# Altium project Receiver.PrjPcb (part 1 of 3)
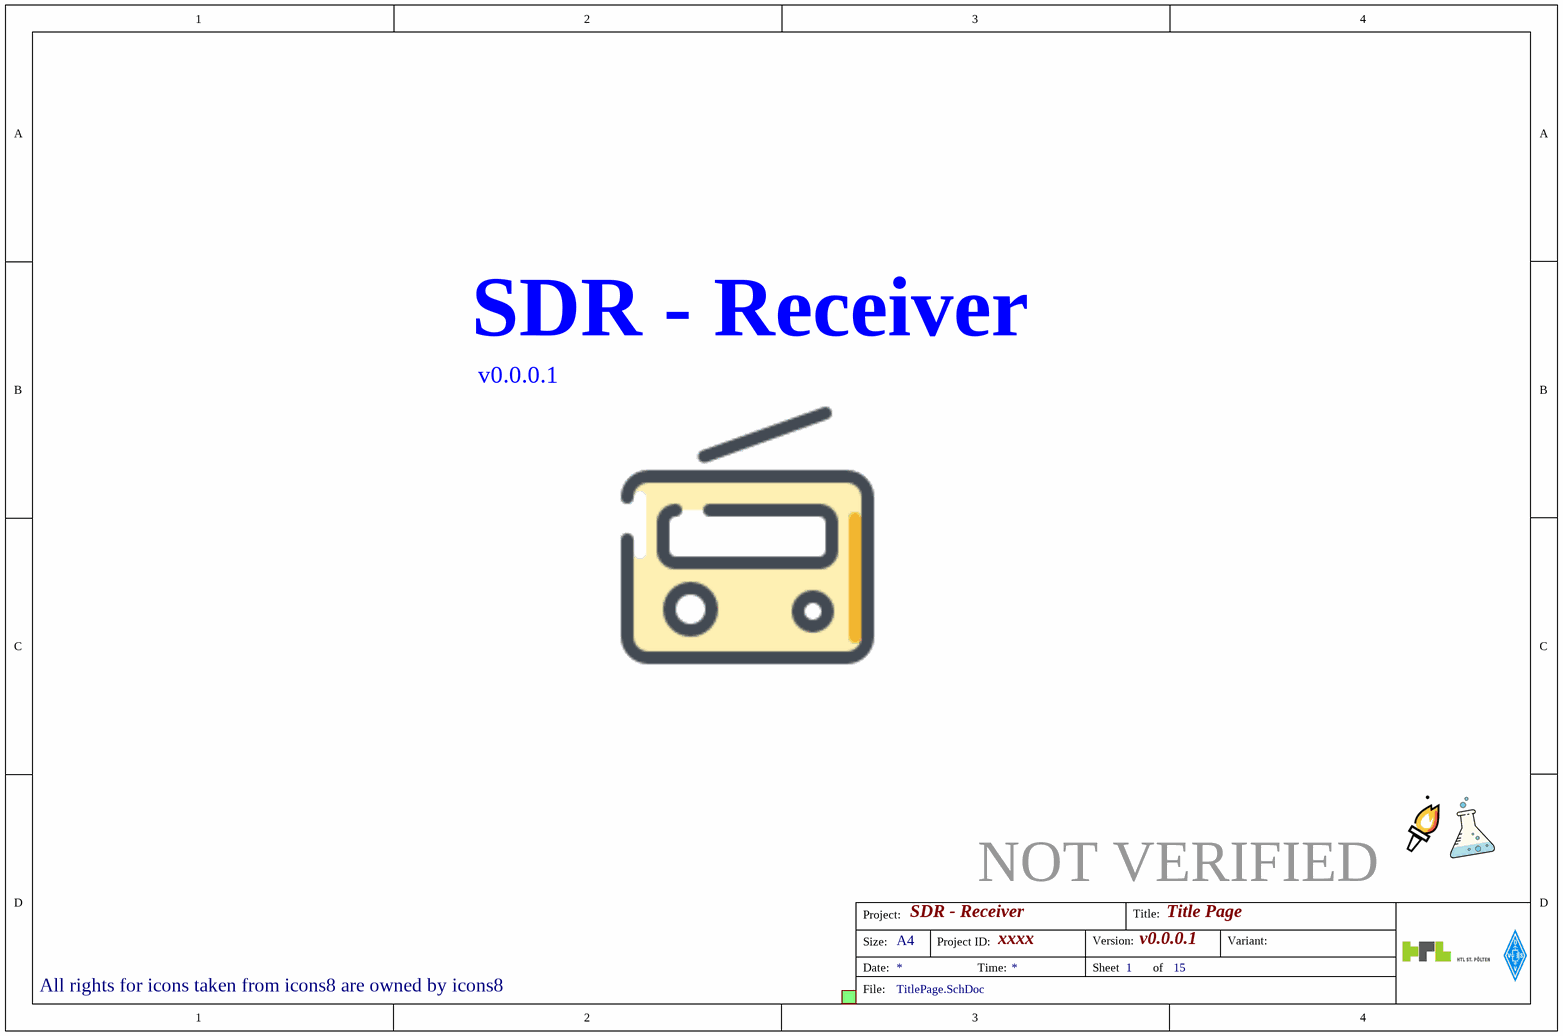
[diagram p0: TitlePage.SchDoc]
Prometheus_Project_ID: xxxx; Prometheus_Release: NOT VERIFIED; Prometheus_Title: SDR - Receiver; Prometheus_Version: v0.0.0.1
15 sheets, 596 parts. Net scope: flat (ports and power ports of the same name join across sheets).
Board file: Receiver.pcbdoc
Sheets:
  TitlePage.SchDoc
    Overview = Overview.SchDoc
      PicoZed = PicoZed.SchDoc
      Power Supply = PowerSupply.SchDoc
      USB & Ethernet = USB_Ethernet.SchDoc
      SD Card = SD_Card.SchDoc
      UART & JTAG = UART_JTAG.SchDoc
      HF Front End = HF_FrontEndOverview.SchDoc
        Low Pass Filter = LowPassFilter.SchDoc
        Programmable Gain Amplifier = ProgrammableGainAmplifier.SchDoc
          ASTG1 = GainBlock.SchDoc
          ASTG2 = GainBlock.SchDoc
          ASTG3 = GainBlock.SchDoc
          Programmable Attenuator = ProgrammableAttenuator.SchDoc
        ADC = ADC.SchDoc
        Clock Generator = ClockGenerator.SchDoc
      Temperature Sensor = TemperatureSensor.SchDoc

## Sheet TitlePage.SchDoc: Title Page
size A4; DrawnBy: Patrik Staudenmayer; DocumentNumber: 1; SheetNumber: 1; SheetTotal: 15

### Sub-sheets
Overview = Overview.SchDoc: no entries

### Notes on the sheet
- SDR - Receiver
- All rights for icons taken from icons8 are owned by icons8 <https://icons8.com>
- Project:
- Title:
- Size:
- Date:
- A4
- Project ID:
- Time:
- Sheet
- Version:
- of
- Variant:
- File:

## Sheet Overview.SchDoc: Overview
size A4; DrawnBy: Patrik Staudenmayer; Organization: Altium Limited; Address1: L3, 12a Rodborough Rd; Address2: Frenchs Forest; Address3: NSW; Address4: Australia 2086; DocumentNumber: 2; SheetNumber: 2; SheetTotal: 15
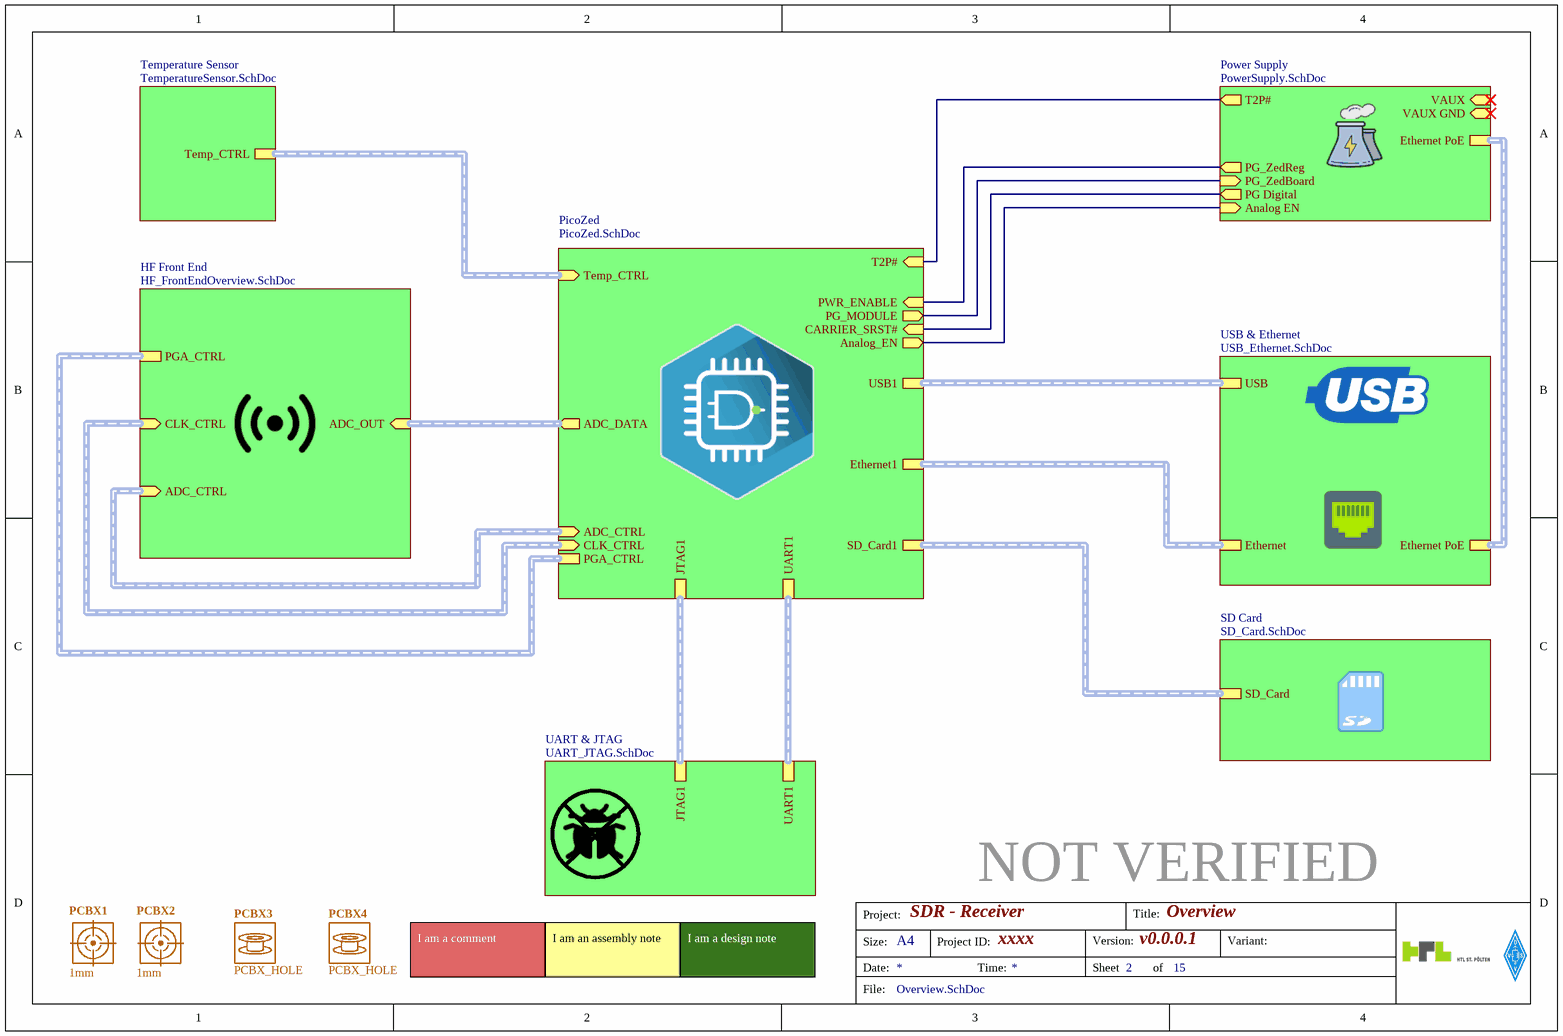
[diagram p1: Overview.SchDoc]

### Parts
PCBX1  1mm  [FIDUCIAL_SINGLESIDE_1mm]  (no BOM)
PCBX2  1mm  [FIDUCIAL_SINGLESIDE_1mm]  (no BOM)
PCBX3  PCBX_HOLE  [TP_FANGFLOCH]  (no BOM)
PCBX4  PCBX_HOLE  [TP_LANGLOCH]  (no BOM)

### Sub-sheets
HF Front End = HF_FrontEndOverview.SchDoc: CLK_CTRL (in, harness CLK_CTRL), ADC_CTRL (in, harness ADC_CTRL), ADC_OUT (in, harness ADC_OUT), PGA_CTRL (harness PGA_CTRL)
PicoZed = PicoZed.SchDoc: USB1 (harness USB), SD_Card1 (harness SD), Ethernet1 (harness Ethernet), JTAG1 (harness JTAG), UART1 (harness UART), PWR_ENABLE (in), PG_MODULE (out), CARRIER_SRST# (in), Analog_EN (out), T2P# (in), ADC_DATA (out, harness ADC_OUT), CLK_CTRL (in, harness CLK_CTRL), ADC_CTRL (in, harness ADC_CTRL), PGA_CTRL, Temp_CTRL (in, harness Temp_CTRL)
Power Supply = PowerSupply.SchDoc: VAUX GND (in), VAUX (in), Ethernet PoE (harness Ethernet PoE), PG Digital (out), PG_ZedBoard (in), PG_ZedReg (out), Analog EN (in), T2P# (out)
SD Card = SD_Card.SchDoc: SD_Card (harness SD)
Temperature Sensor = TemperatureSensor.SchDoc: Temp_CTRL (harness Temp_CTRL)
UART & JTAG = UART_JTAG.SchDoc: JTAG1 (harness JTAG), UART1 (harness UART)
USB & Ethernet = USB_Ethernet.SchDoc: Ethernet PoE (harness Ethernet PoE), Ethernet (harness Ethernet), USB (harness USB)

### Nets
(unnamed): sheet PicoZed/PWR_ENABLE, sheet Power Supply/PG_ZedReg
(unnamed): sheet PicoZed/PG_MODULE, sheet Power Supply/PG_ZedBoard
(unnamed): sheet PicoZed/CARRIER_SRST#, sheet Power Supply/PG Digital
(unnamed): sheet PicoZed/Analog_EN, sheet Power Supply/Analog EN
(unnamed): sheet PicoZed/T2P#, sheet Power Supply/T2P#

### Buses and harness runs
harness sheet HF Front End/ADC_CTRL = sheet PicoZed/ADC_CTRL
harness sheet HF Front End/ADC_OUT = sheet PicoZed/ADC_DATA
harness sheet HF Front End/CLK_CTRL = sheet PicoZed/CLK_CTRL
harness sheet HF Front End/PGA_CTRL = sheet PicoZed/PGA_CTRL
harness sheet PicoZed/Ethernet1 = sheet USB & Ethernet/Ethernet
harness sheet PicoZed/JTAG1 = sheet UART & JTAG/JTAG1
harness sheet PicoZed/SD_Card1 = sheet SD Card/SD_Card
harness sheet PicoZed/Temp_CTRL = sheet Temperature Sensor/Temp_CTRL
harness sheet PicoZed/UART1 = sheet UART & JTAG/UART1
harness sheet PicoZed/USB1 = sheet USB & Ethernet/USB
harness sheet Power Supply/Ethernet PoE = sheet USB & Ethernet/Ethernet PoE

### Notes on the sheet
- I am a comment
- I am an assembly note
- I am a design note
- Project:
- Title:
- Size:
- Date:
- A4
- Project ID:
- Time:
- Sheet
- Version:
- of
- Variant:
- File:

### Library data of the parts
PCBX1 PCBX2 = PCBX_FIDUCIAL: fiducial mark; Prometheus_ID: *; Prometheus_ManPartNo: 1mm; Prometheus_Manufacturer: *; Prometheus_Comment: 1mm; Prometheus_CurrentFootprint: FIDUCIAL_SINGLESIDE_1mm
PCBX3 PCBX4 = PCBX_HOLE: generic PCB hole; Prometheus_ID: *; Prometheus_ManPartNo: PCBX_HOLE; Prometheus_Manufacturer: *; Prometheus_Comment: PCBX_HOLE
  PCBX3: Prometheus_CurrentFootprint: TP_FANGFLOCH
  PCBX4: Prometheus_CurrentFootprint: TP_LANGLOCH

## Sheet PicoZed.SchDoc: Pico Zed
size A2; DrawnBy: Patrik Staudenmayer; Organization: Altium Limited; Address1: L3, 12a Rodborough Rd; Address2: Frenchs Forest; Address3: NSW; Address4: Australia 2086; DocumentNumber: 3; SheetNumber: 3; SheetTotal: 15
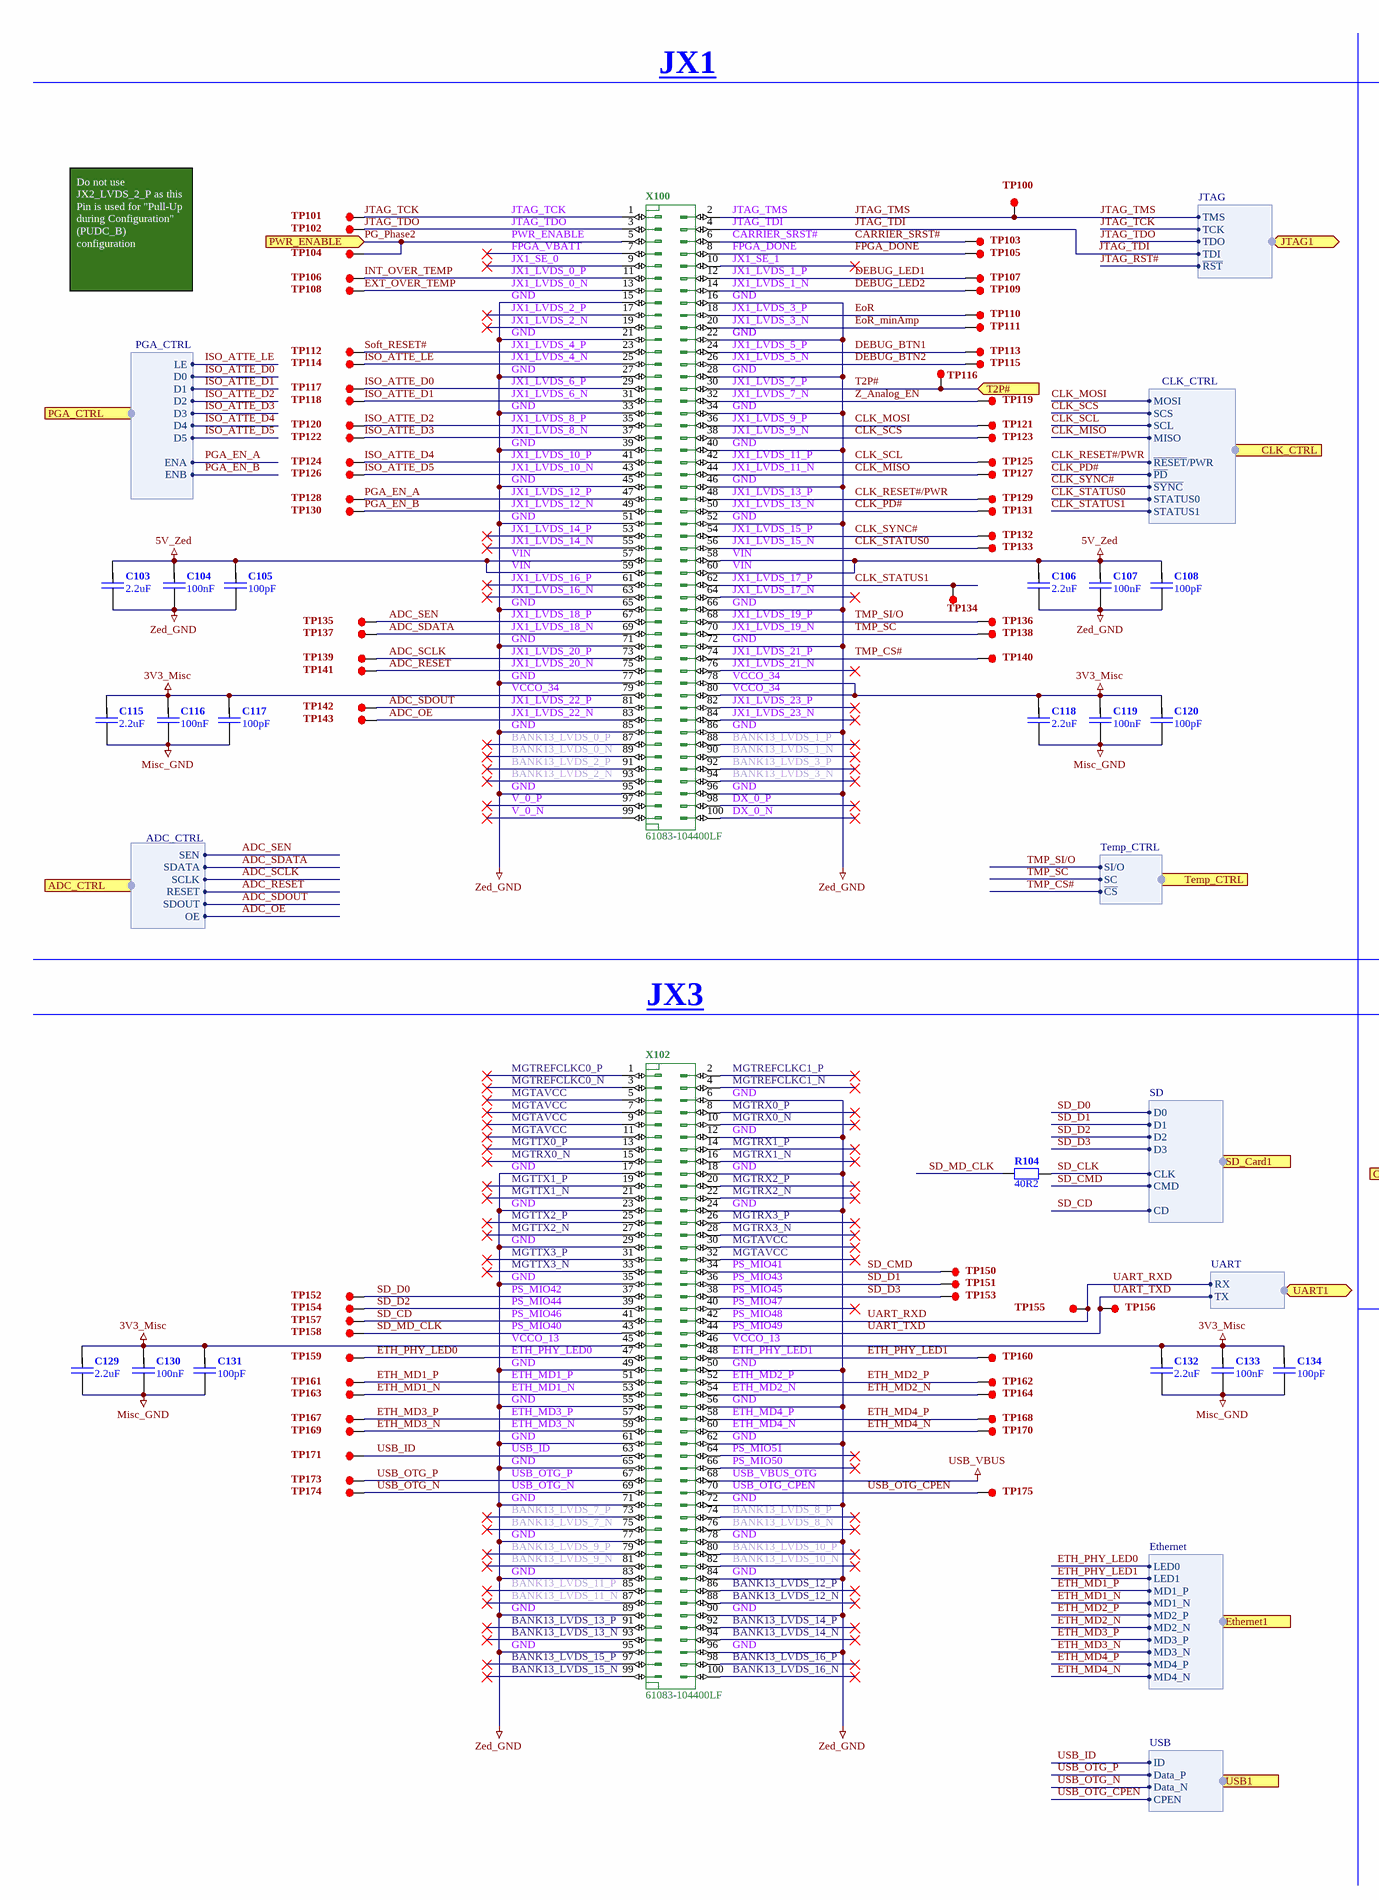
[diagram p2: PicoZed.SchDoc, left]
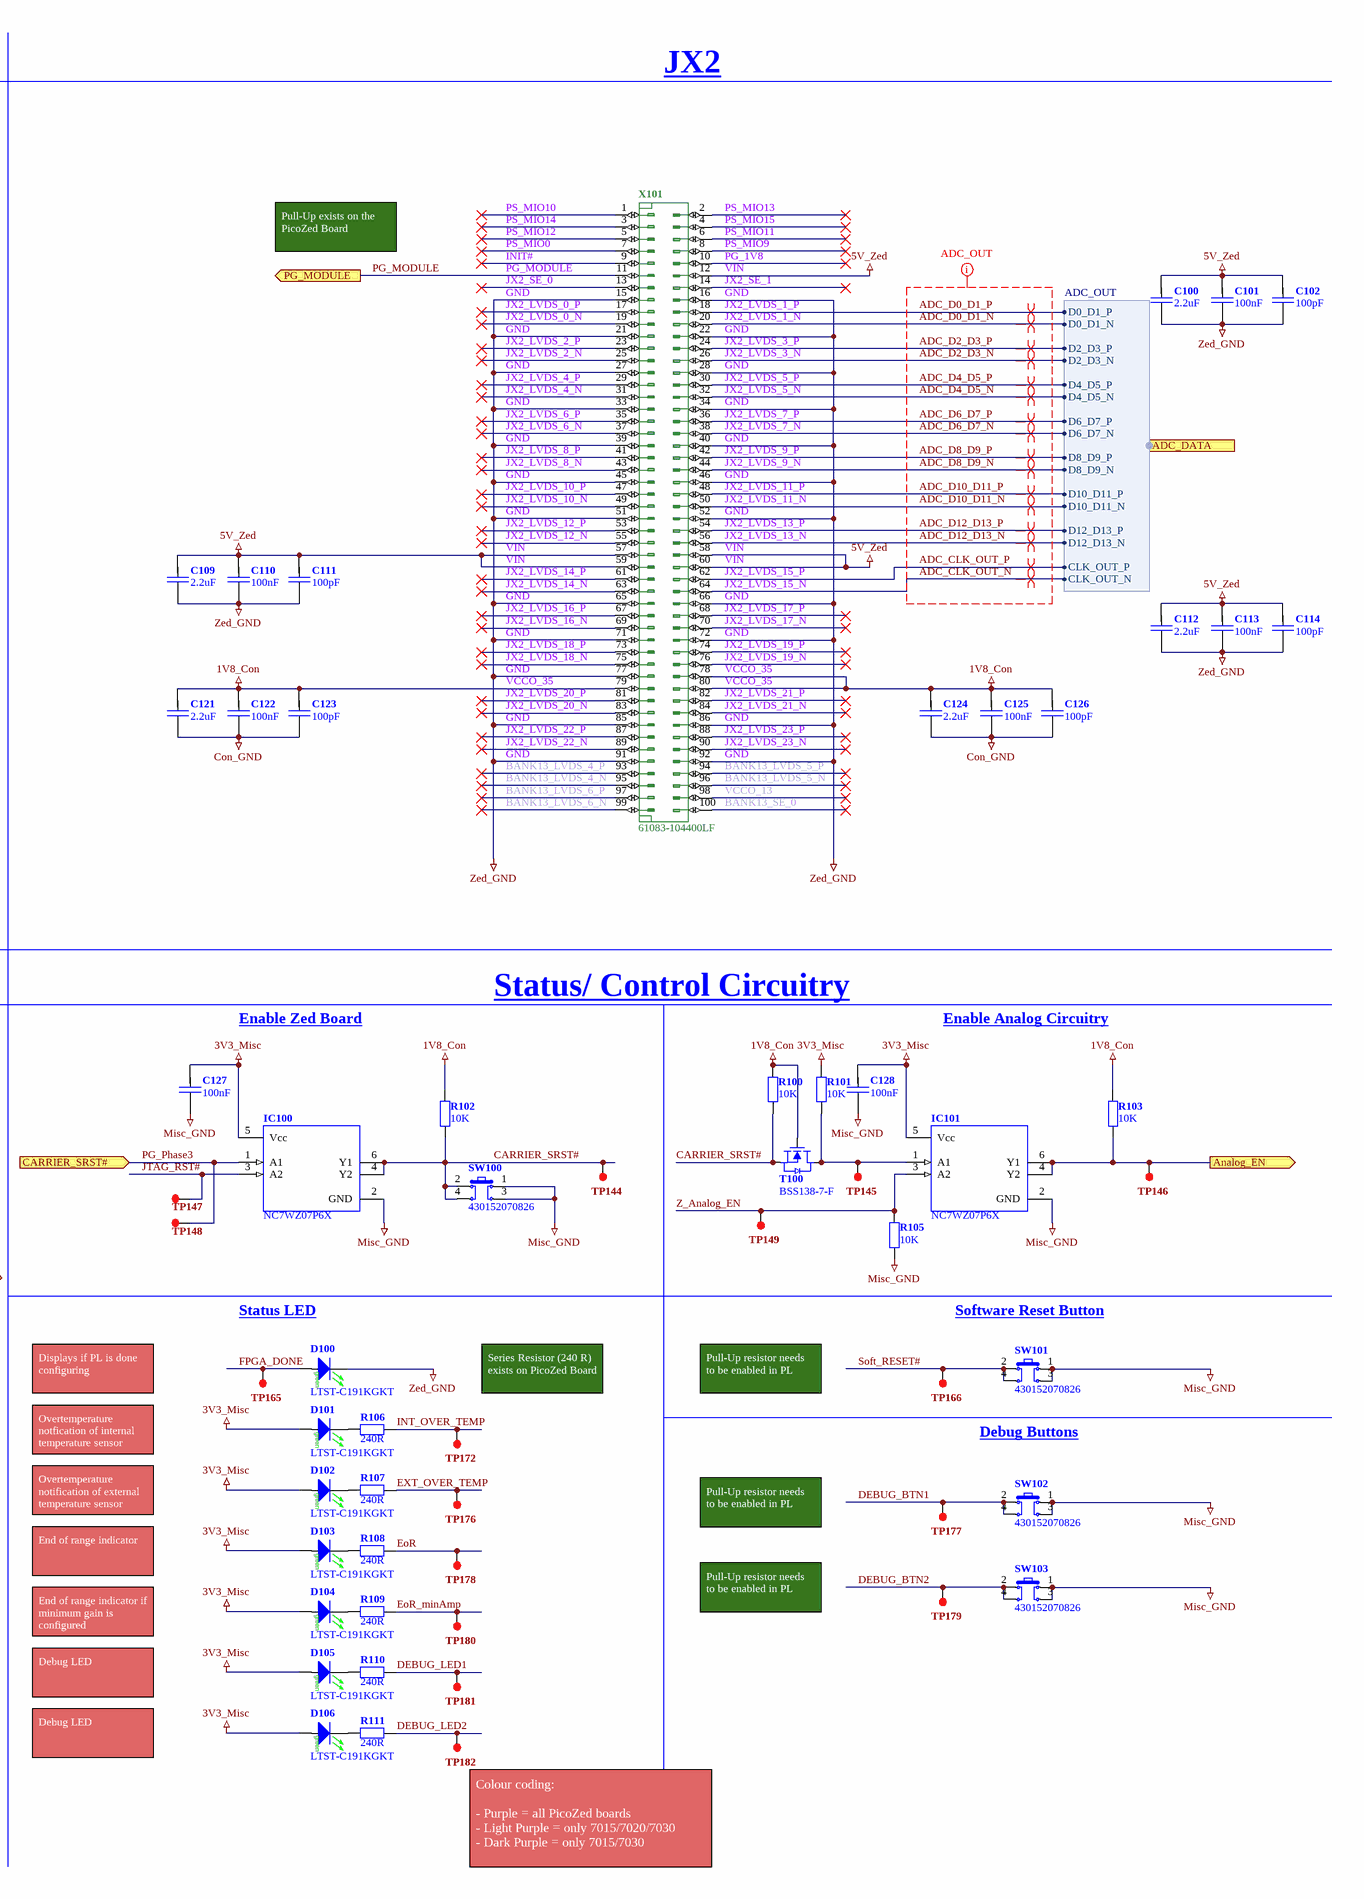
[diagram p3: PicoZed.SchDoc, right]

### Parts
C100  2.2uF  [C_1206_N [CAPC3216N IPC]]
C101  100nF  [C_0805_N [CAPC2013N IPC]]
C102  100pF  [C_0603_N [CAPC1608N IPC]]
C103  2.2uF  [C_1206_N [CAPC3216N IPC]]
C104  100nF  [C_0805_N [CAPC2013N IPC]]
C105  100pF  [C_0603_N [CAPC1608N IPC]]
C106  2.2uF  [C_1206_N [CAPC3216N IPC]]
C107  100nF  [C_0805_N [CAPC2013N IPC]]
C108  100pF  [C_0603_N [CAPC1608N IPC]]
C109  2.2uF  [C_1206_N [CAPC3216N IPC]]
C110  100nF  [C_0805_N [CAPC2013N IPC]]
C111  100pF  [C_0603_N [CAPC1608N IPC]]
C112  2.2uF  [C_1206_N [CAPC3216N IPC]]
C113  100nF  [C_0805_N [CAPC2013N IPC]]
C114  100pF  [C_0603_N [CAPC1608N IPC]]
C115  2.2uF  [C_1206_N [CAPC3216N IPC]]
C116  100nF  [C_0805_N [CAPC2013N IPC]]
C117  100pF  [C_0603_N [CAPC1608N IPC]]
C118  2.2uF  [C_1206_N [CAPC3216N IPC]]
C119  100nF  [C_0805_N [CAPC2013N IPC]]
C120  100pF  [C_0603_N [CAPC1608N IPC]]
C121  2.2uF  [C_1206_N [CAPC3216N IPC]]
C122  100nF  [C_0805_N [CAPC2013N IPC]]
C123  100pF  [C_0603_N [CAPC1608N IPC]]
C124  2.2uF  [C_1206_N [CAPC3216N IPC]]
C125  100nF  [C_0805_N [CAPC2013N IPC]]
C126  100pF  [C_0603_N [CAPC1608N IPC]]
C127  100nF  [C_0603_N [CAPC1608N IPC]]
C128  100nF  [C_0603_N [CAPC1608N IPC]]
C129  2.2uF  [C_1206_N [CAPC3216N IPC]]
C130  100nF  [C_0805_N [CAPC2013N IPC]]
C131  100pF  [C_0603_N [CAPC1608N IPC]]
C132  2.2uF  [C_1206_N [CAPC3216N IPC]]
C133  100nF  [C_0805_N [CAPC2013N IPC]]
C134  100pF  [C_0603_N [CAPC1608N IPC]]
D100  LTST-C191KGKT  [LED_0603-GREEN_N_AK]
D101  LTST-C191KGKT  [LED_0603-GREEN_N_AK]
D102  LTST-C191KGKT  [LED_0603-GREEN_N_AK]
D103  LTST-C191KGKT  [LED_0603-GREEN_N_AK]
D104  LTST-C191KGKT  [LED_0603-GREEN_N_AK]
D105  LTST-C191KGKT  [LED_0603-GREEN_N_AK]
D106  LTST-C191KGKT  [LED_0603-GREEN_N_AK]
IC100  NC7WZ07P6X  [TSOP65P210X110-6N IPC]
IC101  NC7WZ07P6X  [TSOP65P210X110-6N IPC]
R100  10K  [R_0603_N [RESC1608N IPC]]
R101  10K  [R_0603_N [RESC1608N IPC]]
R102  10K  [R_0603_N [RESC1608N IPC]]
R103  10K  [R_0603_N [RESC1608N IPC]]
R104  40R2  [R_0603_M [RESC1608M IPC]]
R105  10K  [R_0603_N [RESC1608N IPC]]
R106  240R  [R_0603_N [RESC1608N IPC]]
R107  240R  [R_0603_N [RESC1608N IPC]]
R108  240R  [R_0603_N [RESC1608N IPC]]
R109  240R  [R_0603_N [RESC1608N IPC]]
R110  240R  [R_0603_N [RESC1608N IPC]]
R111  240R  [R_0603_N [RESC1608N IPC]]
SW100  430152070826  [SW_430152070826]
SW101  430152070826  [SW_430152070826]
SW102  430152070826  [SW_430152070826]
SW103  430152070826  [SW_430152070826]
T100  BSS138-7-F  [SOT105P235X102-3N IPC]
TP100  TP_GENERIC  [TP_0.8_P100T]  (value not drawn)  (no BOM)
TP101  TP_GENERIC  [TP_0.8_P100T]  (value not drawn)  (no BOM)
TP102  TP_GENERIC  [TP_0.8_P100T]  (value not drawn)  (no BOM)
TP103  TP_GENERIC  [TP_0.8_P100T]  (value not drawn)  (no BOM)
TP104  TP_GENERIC  [TP_0.8_P100T]  (value not drawn)  (no BOM)
TP105  TP_GENERIC  [TP_0.8_P100T]  (value not drawn)  (no BOM)
TP106  TP_GENERIC  [TP_0.8_P100T]  (value not drawn)  (no BOM)
TP107  TP_GENERIC  [TP_0.8_P100T]  (value not drawn)  (no BOM)
TP108  TP_GENERIC  [TP_0.8_P100T]  (value not drawn)  (no BOM)
TP109  TP_GENERIC  [TP_0.8_P100T]  (value not drawn)  (no BOM)
TP110  TP_GENERIC  [TP_0.8_P100T]  (value not drawn)  (no BOM)
TP111  TP_GENERIC  [TP_0.8_P100T]  (value not drawn)  (no BOM)
TP112  TP_GENERIC  [TP_0.8_P100T]  (value not drawn)  (no BOM)
TP113  TP_GENERIC  [TP_0.8_P100T]  (value not drawn)  (no BOM)
TP114  TP_GENERIC  [TP_0.8_P100T]  (value not drawn)  (no BOM)
TP115  TP_GENERIC  [TP_0.8_P100T]  (value not drawn)  (no BOM)
TP116  TP_GENERIC  [TP_0.8_P100T]  (value not drawn)  (no BOM)
TP117  TP_GENERIC  [TP_0.8_P100T]  (value not drawn)  (no BOM)
TP118  TP_GENERIC  [TP_0.8_P100T]  (value not drawn)  (no BOM)
TP119  TP_GENERIC  [TP_0.8_P100T]  (value not drawn)  (no BOM)
TP120  TP_GENERIC  [TP_0.8_P100T]  (value not drawn)  (no BOM)
TP121  TP_GENERIC  [TP_0.8_P100T]  (value not drawn)  (no BOM)
TP122  TP_GENERIC  [TP_0.8_P100T]  (value not drawn)  (no BOM)
TP123  TP_GENERIC  [TP_0.8_P100T]  (value not drawn)  (no BOM)
TP124  TP_GENERIC  [TP_0.8_P100T]  (value not drawn)  (no BOM)
TP125  TP_GENERIC  [TP_0.8_P100T]  (value not drawn)  (no BOM)
TP126  TP_GENERIC  [TP_0.8_P100T]  (value not drawn)  (no BOM)
TP127  TP_GENERIC  [TP_0.8_P100T]  (value not drawn)  (no BOM)
TP128  TP_GENERIC  [TP_0.8_P100T]  (value not drawn)  (no BOM)
TP129  TP_GENERIC  [TP_0.8_P100T]  (value not drawn)  (no BOM)
TP130  TP_GENERIC  [TP_0.8_P100T]  (value not drawn)  (no BOM)
TP131  TP_GENERIC  [TP_0.8_P100T]  (value not drawn)  (no BOM)
TP132  TP_GENERIC  [TP_0.8_P100T]  (value not drawn)  (no BOM)
TP133  TP_GENERIC  [TP_0.8_P100T]  (value not drawn)  (no BOM)
TP134  TP_GENERIC  [TP_0.8_P100T]  (value not drawn)  (no BOM)
TP135  TP_GENERIC  [TP_0.8_P100T]  (value not drawn)  (no BOM)
TP136  TP_GENERIC  [TP_0.8_P100T]  (value not drawn)  (no BOM)
TP137  TP_GENERIC  [TP_0.8_P100T]  (value not drawn)  (no BOM)
TP138  TP_GENERIC  [TP_0.8_P100T]  (value not drawn)  (no BOM)
TP139  TP_GENERIC  [TP_0.8_P100T]  (value not drawn)  (no BOM)
TP140  TP_GENERIC  [TP_0.8_P100T]  (value not drawn)  (no BOM)
TP141  TP_GENERIC  [TP_0.8_P100T]  (value not drawn)  (no BOM)
TP142  TP_GENERIC  [TP_0.8_P100T]  (value not drawn)  (no BOM)
TP143  TP_GENERIC  [TP_0.8_P100T]  (value not drawn)  (no BOM)
TP144  TP_GENERIC  [TP_0.8_P100T]  (value not drawn)  (no BOM)
TP145  TP_GENERIC  [TP_0.8_P100T]  (value not drawn)  (no BOM)
TP146  TP_GENERIC  [TP_0.8_P100T]  (value not drawn)  (no BOM)
TP147  TP_GENERIC  [TP_0.8_P100T]  (value not drawn)  (no BOM)
TP148  TP_GENERIC  [TP_0.8_P100T]  (value not drawn)  (no BOM)
TP149  TP_GENERIC  [TP_0.8_P100T]  (value not drawn)  (no BOM)
TP150  TP_GENERIC  [TP_0.8_P100T]  (value not drawn)  (no BOM)
TP151  TP_GENERIC  [TP_0.8_P100T]  (value not drawn)  (no BOM)
TP152  TP_GENERIC  [TP_0.8_P100T]  (value not drawn)  (no BOM)
TP153  TP_GENERIC  [TP_0.8_P100T]  (value not drawn)  (no BOM)
TP154  TP_GENERIC  [TP_0.8_P100T]  (value not drawn)  (no BOM)
TP155  TP_GENERIC  [TP_0.8_P100T]  (value not drawn)  (no BOM)
TP156  TP_GENERIC  [TP_0.8_P100T]  (value not drawn)  (no BOM)
TP157  TP_GENERIC  [TP_0.8_P100T]  (value not drawn)  (no BOM)
TP158  TP_GENERIC  [TP_0.8_P100T]  (value not drawn)  (no BOM)
TP159  TP_GENERIC  [TP_0.8_P100T]  (value not drawn)  (no BOM)
TP160  TP_GENERIC  [TP_0.8_P100T]  (value not drawn)  (no BOM)
TP161  TP_GENERIC  [TP_0.8_P100T]  (value not drawn)  (no BOM)
TP162  TP_GENERIC  [TP_0.8_P100T]  (value not drawn)  (no BOM)
TP163  TP_GENERIC  [TP_0.8_P100T]  (value not drawn)  (no BOM)
TP164  TP_GENERIC  [TP_0.8_P100T]  (value not drawn)  (no BOM)
TP165  TP_GENERIC  [TP_0.8_P100T]  (value not drawn)  (no BOM)
TP166  TP_GENERIC  [TP_0.8_P100T]  (value not drawn)  (no BOM)
TP167  TP_GENERIC  [TP_0.8_P100T]  (value not drawn)  (no BOM)
TP168  TP_GENERIC  [TP_0.8_P100T]  (value not drawn)  (no BOM)
TP169  TP_GENERIC  [TP_0.8_P100T]  (value not drawn)  (no BOM)
TP170  TP_GENERIC  [TP_0.8_P100T]  (value not drawn)  (no BOM)
TP171  TP_GENERIC  [TP_0.8_P100T]  (value not drawn)  (no BOM)
TP172  TP_GENERIC  [TP_0.8_P100T]  (value not drawn)  (no BOM)
TP173  TP_GENERIC  [TP_0.8_P100T]  (value not drawn)  (no BOM)
TP174  TP_GENERIC  [TP_0.8_P100T]  (value not drawn)  (no BOM)
TP175  TP_GENERIC  [TP_0.8_P100T]  (value not drawn)  (no BOM)
TP176  TP_GENERIC  [TP_0.8_P100T]  (value not drawn)  (no BOM)
TP177  TP_GENERIC  [TP_0.8_P100T]  (value not drawn)  (no BOM)
TP178  TP_GENERIC  [TP_0.8_P100T]  (value not drawn)  (no BOM)
TP179  TP_GENERIC  [TP_0.8_P100T]  (value not drawn)  (no BOM)
TP180  TP_GENERIC  [TP_0.8_P100T]  (value not drawn)  (no BOM)
TP181  TP_GENERIC  [TP_0.8_P100T]  (value not drawn)  (no BOM)
TP182  TP_GENERIC  [TP_0.8_P100T]  (value not drawn)  (no BOM)
X100  61083-104400LF  [X_61083-104400LF]
X101  61083-104400LF  [X_61083-104400LF]
X102  61083-104400LF  [X_61083-104400LF]

### Ports
ADC_CTRL (harness ADC_CTRL), ADC_DATA (harness ADC_OUT), Analog_EN (out), CARRIER_SRST# (in), CLK_CTRL (harness CLK_CTRL), Ethernet1 (harness Ethernet), JTAG1 (bidir, harness JTAG), PG_MODULE (out), PGA_CTRL (harness PGA_CTRL), PWR_ENABLE (in), SD_Card1 (harness SD), T2P# (in), Temp_CTRL (in, harness Temp_CTRL), UART1 (bidir, harness UART), USB1 (harness USB)

### Harnesses
SD: CLK, D0, D1, D2, D3, CD, CMD
USB: ID, Data_P, Data_N, CPEN
Ethernet: LED0, LED1, MD1_P, MD1_N, MD2_P, MD2_N, MD3_P, MD3_N, MD4_P, MD4_N
JTAG: TMS, TCK, TDI, TDO, ~{RST}
UART: TX, RX
ADC_OUT: D0_D1_N, D0_D1_P, D2_D3_N, D2_D3_P, D4_D5_N, D4_D5_P, D6_D7_N, D6_D7_P, D8_D9_N, D8_D9_P, D10_D11_N, D10_D11_P, D12_D13_N, D12_D13_P, CLK_OUT_P, CLK_OUT_N
CLK_CTRL: MOSI, SCS, SCL, MISO, ~{RESET}/PWR, ~{PD}, ~{SYNC}, STATUS0, STATUS1
ADC_CTRL: SEN, SDATA, SCLK, RESET, SDOUT, OE
PGA_CTRL: LE, D0, D1, D2, D3, D4, D5, ENA, ENB
Temp_CTRL: SI/O, SC, ~{CS}

### Nets
1V8_Con: C121.1 C122.1 C123.1 C124.1 C125.1 C126.1 R100.2 R102.2 R103.2 T100.G X101.78 X101.79 X101.80
3V3_Misc: C115.1 C116.1 C117.1 C118.1 C119.1 C120.1 C127.1 C128.1 C129.1 C130.1 C131.1 C132.1 C133.1 C134.1 D101.A D102.A D103.A D104.A D105.A D106.A IC100.5(Vcc) IC101.5(Vcc) R101.2 X100.78 X100.79 X100.80 X102.45 X102.46
5V_Zed: C100.1 C101.1 C102.1 C103.1 C104.1 C105.1 C106.1 C107.1 C108.1 C109.1 C110.1 C111.1 C112.1 C113.1 C114.1 X100.57 X100.58 X100.59 X100.60 X101.12 X101.57 X101.58 X101.59 X101.60
Con_GND: C100.2 C101.2 C102.2 C103.2 C104.2 C105.2 C106.2 C107.2 C108.2 C109.2 C110.2 C111.2 C112.2 C113.2 C114.2 C115.2 C116.2 C117.2 C118.2 C119.2 C120.2 C121.2 C122.2 C123.2 C124.2 C125.2 C126.2 C127.2 C128.2 C129.2 C130.2 C131.2 C132.2 C133.2 C134.2 D100.K IC100.2(GND) IC101.2(GND) R105.1 SW100.1 SW100.3 SW101.1 SW101.3 SW102.1 SW102.3 SW103.1 SW103.3 X100.15 X100.16 X100.21 X100.22 X100.27 X100.28 X100.33 X100.34 X100.39 X100.40 X100.45 X100.46 X100.51 X100.52 X100.65 X100.66 X100.71 X100.72 X100.77 X100.85 X100.86 X100.95 X100.96 X101.15 X101.16 X101.21 X101.22 X101.27 X101.28 X101.33 X101.34 X101.39 X101.40 X101.45 X101.46 X101.51 X101.52 X101.65 X101.66 X101.71 X101.72 X101.77 X101.85 X101.86 X101.91 X101.92 X102.6 X102.12 X102.17 X102.18 X102.23 X102.24 X102.29 X102.35 X102.49 X102.50 X102.55 X102.56 X102.61 X102.62 X102.65 X102.71 X102.72 X102.77 X102.78 X102.83 X102.84 X102.89 X102.90 X102.95 X102.96  [also labelled Misc_GND, Zed_GND]
USB_VBUS: X102.68
ADC_CLK_OUT_N: X101.64 ; port ADC_DATA.CLK_OUT_N
ADC_CLK_OUT_P: X101.62 ; port ADC_DATA.CLK_OUT_P
ADC_D0_D1_N: X101.20 ; port ADC_DATA.D0_D1_N
ADC_D0_D1_P: X101.18 ; port ADC_DATA.D0_D1_P
ADC_D2_D3_N: X101.26 ; port ADC_DATA.D2_D3_N
ADC_D2_D3_P: X101.24 ; port ADC_DATA.D2_D3_P
ADC_D4_D5_N: X101.32 ; port ADC_DATA.D4_D5_N
ADC_D4_D5_P: X101.30 ; port ADC_DATA.D4_D5_P
ADC_D6_D7_N: X101.38 ; port ADC_DATA.D6_D7_N
ADC_D6_D7_P: X101.36 ; port ADC_DATA.D6_D7_P
ADC_D8_D9_N: X101.44 ; port ADC_DATA.D8_D9_N
ADC_D8_D9_P: X101.42 ; port ADC_DATA.D8_D9_P
ADC_D10_D11_N: X101.50 ; port ADC_DATA.D10_D11_N
ADC_D10_D11_P: X101.48 ; port ADC_DATA.D10_D11_P
ADC_D12_D13_N: X101.56 ; port ADC_DATA.D12_D13_N
ADC_D12_D13_P: X101.54 ; port ADC_DATA.D12_D13_P
ADC_OE: TP143.1 X100.83 ; port ADC_CTRL.OE
ADC_RESET: TP141.1 X100.75 ; port ADC_CTRL.RESET
ADC_SCLK: TP139.1 X100.73 ; port ADC_CTRL.SCLK
ADC_SDATA: TP137.1 X100.69 ; port ADC_CTRL.SDATA
ADC_SDOUT: TP142.1 X100.81 ; port ADC_CTRL.SDOUT
ADC_SEN: TP135.1 X100.67 ; port ADC_CTRL.SEN
CARRIER_SRST#: IC100.4(Y2) IC100.6(Y1) R100.1 R102.1 SW100.2 SW100.4 T100.S TP103.1 TP144.1 X100.6
CLK_MISO: TP127.1 X100.44 ; port CLK_CTRL.MISO
CLK_MOSI: TP121.1 X100.36 ; port CLK_CTRL.MOSI
CLK_PD#: TP131.1 X100.50 ; port CLK_CTRL.~{PD}
CLK_RESET#/PWR: TP129.1 X100.48 ; port CLK_CTRL.~{RESET}/PWR
CLK_SCL: TP125.1 X100.42 ; port CLK_CTRL.SCL
CLK_SCS: TP123.1 X100.38 ; port CLK_CTRL.SCS
CLK_STATUS0: TP133.1 X100.56 ; port CLK_CTRL.STATUS0
CLK_STATUS1: TP134.1 X100.62 ; port CLK_CTRL.STATUS1
CLK_SYNC#: TP132.1 X100.54 ; port CLK_CTRL.~{SYNC}
DEBUG_BTN1: SW102.2 SW102.4 TP113.1 TP177.1 X100.24
DEBUG_BTN2: SW103.2 SW103.4 TP115.1 TP179.1 X100.26
DEBUG_LED1: R110.1 TP107.1 TP181.1 X100.12
DEBUG_LED2: R111.1 TP109.1 TP182.1 X100.14
EoR: R108.1 TP110.1 TP178.1 X100.18
EoR_minAmp: R109.1 TP111.1 TP180.1 X100.20
ETH_MD1_N: TP163.1 X102.53 ; port Ethernet1.MD1_N
ETH_MD1_P: TP161.1 X102.51 ; port Ethernet1.MD1_P
ETH_MD2_N: TP164.1 X102.54 ; port Ethernet1.MD2_N
ETH_MD2_P: TP162.1 X102.52 ; port Ethernet1.MD2_P
ETH_MD3_N: TP169.1 X102.59 ; port Ethernet1.MD3_N
ETH_MD3_P: TP167.1 X102.57 ; port Ethernet1.MD3_P
ETH_MD4_N: TP170.1 X102.60 ; port Ethernet1.MD4_N
ETH_MD4_P: TP168.1 X102.58 ; port Ethernet1.MD4_P
ETH_PHY_LED0: TP159.1 X102.47 ; port Ethernet1.LED0
ETH_PHY_LED1: TP160.1 X102.48 ; port Ethernet1.LED1
EXT_OVER_TEMP: R107.1 TP108.1 TP176.1 X100.13
FPGA_DONE: D100.A TP105.1 TP165.1 X100.8
INT_OVER_TEMP: R106.1 TP106.1 TP172.1 X100.11
ISO_ATTE_D0: TP117.1 X100.29 ; port PGA_CTRL.D0
ISO_ATTE_D1: TP118.1 X100.31 ; port PGA_CTRL.D1
ISO_ATTE_D2: TP120.1 X100.35 ; port PGA_CTRL.D2
ISO_ATTE_D3: TP122.1 X100.37 ; port PGA_CTRL.D3
ISO_ATTE_D4: TP124.1 X100.41 ; port PGA_CTRL.D4
ISO_ATTE_D5: TP126.1 X100.43 ; port PGA_CTRL.D5
ISO_ATTE_LE: TP114.1 X100.25 ; port PGA_CTRL.LE
JTAG_RST#: IC100.3(A2) TP147.1 ; port JTAG1.~{RST}
JTAG_TCK: TP101.1 X100.1 ; port JTAG1.TCK
JTAG_TDI: X100.4 ; port JTAG1.TDI
JTAG_TDO: TP102.1 X100.3 ; port JTAG1.TDO
JTAG_TMS: TP100.1 X100.2 ; port JTAG1.TMS
PG_MODULE: X101.11 ; port PG_MODULE
PG_Phase2: TP104.1 X100.5 ; port PWR_ENABLE
PG_Phase3: IC100.1(A1) TP148.1 ; port CARRIER_SRST#
PGA_EN_A: TP128.1 X100.47 ; port PGA_CTRL.ENA
PGA_EN_B: TP130.1 X100.49 ; port PGA_CTRL.ENB
SD_CD: TP157.1 X102.41 ; port SD_Card1.CD
SD_CLK: R104.1 ; port SD_Card1.CLK
SD_CMD: TP150.1 X102.34 ; port SD_Card1.CMD
SD_D0: TP152.1 X102.37 ; port SD_Card1.D0
SD_D1: TP151.1 X102.36 ; port SD_Card1.D1
SD_D2: TP154.1 X102.39 ; port SD_Card1.D2
SD_D3: TP153.1 X102.38 ; port SD_Card1.D3
SD_MD_CLK: R104.2 TP158.1 X102.43
Soft_RESET#: SW101.2 SW101.4 TP112.1 TP166.1 X100.23
T2P#: TP116.1 X100.30 ; port T2P#
TMP_CS#: TP140.1 X100.74 ; port Temp_CTRL.~{CS}
TMP_SC: TP138.1 X100.70 ; port Temp_CTRL.SC
TMP_SI/O: TP136.1 X100.68 ; port Temp_CTRL.SI/O
UART_RXD: TP155.1 X102.42 ; port UART1.RX
UART_TXD: TP156.1 X102.44 ; port UART1.TX
USB_ID: TP171.1 X102.63 ; port USB1.ID
USB_OTG_CPEN: TP175.1 X102.70 ; port USB1.CPEN
USB_OTG_N: TP174.1 X102.69 ; port USB1.Data_N
USB_OTG_P: TP173.1 X102.67 ; port USB1.Data_P
Z_Analog_EN: IC101.3(A2) R105.2 TP119.1 TP149.1 X100.32
NetD101_K: D101.K R106.2
NetD102_K: D102.K R107.2
NetD103_K: D103.K R108.2
NetD104_K: D104.K R109.2
NetD105_K: D105.K R110.2
NetD106_K: D106.K R111.2
NetIC101_1: IC101.1(A1) R101.1 T100.D TP145.1
NetIC101_4: IC101.4(Y2) IC101.6(Y1) R103.1 TP146.1 ; port Analog_EN

Not connected (* = marked no-connect by the designer): X100 7* 9* 10* 17* 19* 53* 55* 61* 63* 64* 76* 82* 84* 87* 88* 89* 90* 91* 92* 93* 94* 97* 98* 99* 100*; X101 1* 2* 3* 4* 5* 6* 7* 8* 9* 10* 13* 14* 17* 19* 23* 25* 29* 31* 35* 37* 41* 43* 47* 49* 53* 55* 61* 63* 67* 68* 69* 70* 73* 74* 75* 76* 81* 82* 83* 84* 87* 88* 89* 90* 93* 94* 95* 96* 97* 98* 99* 100*; X102 1* 2* 3* 4* 5* 7* 8* 9* 10* 11* 13* 14* 15* 16* 19* 20* 21* 22* 25* 26* 27* 28* 30* 31* 32* 33* 40* 64* 66* 73* 74* 75* 76* 79* 80* 81* 82* 85* 86* 87* 88* 91* 92* 93* 94* 97* 98* 99* 100*

### Layout directives
differential pair: ADC_CLK_OUT_N, ADC_CLK_OUT_P, ADC_D0_D1_N, ADC_D0_D1_P, ADC_D2_D3_N, ADC_D2_D3_P, ADC_D4_D5_N, ADC_D4_D5_P, ADC_D6_D7_N, ADC_D6_D7_P, ADC_D8_D9_N, ADC_D8_D9_P, ADC_D10_D11_N, ADC_D10_D11_P, ADC_D12_D13_N, ADC_D12_D13_P
rule Maximum Via Count Constraint [Max Count = 2]; rule Differential Pairs Routing [Pref Gap = 5mil    Min Gap  = 5mil    Max Gap  = 5milPref Width = 4.138mil    Min Width  = 2.925mil    Max Width  = 4.138mil]; rule Matched Net Lengths [Tolerance = 25mil]; net class ADC_OUT: ADC_CLK_OUT_N, ADC_CLK_OUT_P, ADC_D0_D1_N, ADC_D0_D1_P, ADC_D2_D3_N, ADC_D2_D3_P, ADC_D4_D5_N, ADC_D4_D5_P, ADC_D6_D7_N, ADC_D6_D7_P, ADC_D8_D9_N, ADC_D8_D9_P, ADC_D10_D11_N, ADC_D10_D11_P, ADC_D12_D13_N, ADC_D12_D13_P

### Notes on the sheet
- JX1
- JX2
- JTAG_TCK
- JTAG_TDO
- (near X100) JTAG_TMS
- (near X100) JTAG_TDI
- PS_MIO10
- PS_MIO14
- (near X101) PS_MIO13
- (near X101) PS_MIO15
- Do not use JX2_LVDS_2_P as this Pin is used for "Pull-Up during Configuration" (PUDC_B) configuration
- PWR_ENABLE
- FPGA_VBATT
- JX1_SE_0
- JX1_LVDS_0_P
- JX1_LVDS_0_N
- (near X100) CARRIER_SRST#
- (near X100) FPGA_DONE
- (near X100) JX1_SE_1
- (near X100) JX1_LVDS_1_P
- (near X100) JX1_LVDS_1_N
- Pull-Up exists on the PicoZed Board
- PS_MIO12
- PS_MIO0
- INIT#
- PG_MODULE
- JX2_SE_0
- (near X101) VIN
- (near X101) PS_MIO11
- (near X101) PS_MIO9
- (near X101) PG_1V8
- (near X101) JX2_SE_1
- GND
- JX1_LVDS_2_P
- JX1_LVDS_2_N
- JX1_LVDS_4_P
- (near X100) GND
- (near X100) JX1_LVDS_3_P
- (near X100) JX1_LVDS_3_N
- (near X100) JX1_LVDS_5_P
- JX2_LVDS_0_P
- JX2_LVDS_0_N
- JX2_LVDS_2_P
- (near X101) GND
- (near X101) JX2_LVDS_1_P
- (near X101) JX2_LVDS_1_N
- (near X101) JX2_LVDS_3_P
- JX1_LVDS_4_N
- JX1_LVDS_6_P
- JX1_LVDS_6_N
- (near X100) JX1_LVDS_5_N
- (near X100) JX1_LVDS_7_P
- (near X100) JX1_LVDS_7_N
- JX2_LVDS_2_N
- JX2_LVDS_4_P
- JX2_LVDS_4_N
- (near X101) JX2_LVDS_3_N
- (near X101) JX2_LVDS_5_P
- (near X101) JX2_LVDS_5_N
- JX1_LVDS_8_P
- JX1_LVDS_8_N
- JX1_LVDS_10_P
- JX1_LVDS_10_N
- (near X100) JX1_LVDS_9_P
- (near X100) JX1_LVDS_9_N
- (near X100) JX1_LVDS_11_P
- (near X100) JX1_LVDS_11_N
- JX2_LVDS_6_P
- JX2_LVDS_6_N
- JX2_LVDS_8_P
- JX2_LVDS_8_N
- (near X101) JX2_LVDS_7_P
- (near X101) JX2_LVDS_7_N
- (near X101) JX2_LVDS_9_P
- (near X101) JX2_LVDS_9_N
- JX1_LVDS_12_P
- JX1_LVDS_12_N
- JX1_LVDS_14_P
- (near X100) JX1_LVDS_13_N
- (near X100) JX1_LVDS_13_P
- (near X100) JX1_LVDS_15_P
- JX2_LVDS_10_P
- JX2_LVDS_10_N
- JX2_LVDS_12_P
- (near X101) JX2_LVDS_11_P
- (near X101) JX2_LVDS_11_N
- (near X101) JX2_LVDS_13_P
- VIN
- JX1_LVDS_14_N
- JX1_LVDS_16_P
- JX1_LVDS_16_N
- (near X100) VIN
- (near X100) JX1_LVDS_15_N
- (near X100) JX1_LVDS_17_P
- (near X100) JX1_LVDS_17_N
- JX2_LVDS_12_N
- JX2_LVDS_14_P
- JX2_LVDS_14_N
- (near X101) JX2_LVDS_13_N
- (near X101) JX2_LVDS_15_P
- (near X101) JX2_LVDS_15_N
- JX1_LVDS_18_P
- JX1_LVDS_18_N
- JX1_LVDS_20_P
- (near X100) JX1_LVDS_19_P
- (near X100) JX1_LVDS_19_N
- (near X100) JX1_LVDS_21_P
- JX2_LVDS_16_P
- JX2_LVDS_16_N
- JX2_LVDS_18_P
- (near X101) JX2_LVDS_17_P
- (near X101) JX2_LVDS_17_N
- (near X101) JX2_LVDS_19_P
- VCCO_34
- JX1_LVDS_20_N
- JX1_LVDS_22_P
- JX1_LVDS_22_N
- (near X100) VCCO_34
- (near X100) JX1_LVDS_21_N
- (near X100) JX1_LVDS_23_P
- (near X100) JX1_LVDS_23_N
- VCCO_35
- JX2_LVDS_18_N
- JX2_LVDS_20_P
- JX2_LVDS_20_N
- (near X101) VCCO_35
- (near X101) JX2_LVDS_19_N
- (near X101) JX2_LVDS_21_P
- (near X101) JX2_LVDS_21_N
- BANK13_LVDS_0_P
- BANK13_LVDS_0_N
- BANK13_LVDS_2_P
- BANK13_LVDS_2_N
- (near X100) BANK13_LVDS_1_P
- (near X100) BANK13_LVDS_1_N
- (near X100) BANK13_LVDS_3_P
- (near X100) BANK13_LVDS_3_N
- JX2_LVDS_22_P
- JX2_LVDS_22_N
- BANK13_LVDS_4_P
- (near X101) JX2_LVDS_23_P
- (near X101) JX2_LVDS_23_N
- (near X101) BANK13_LVDS_5_P
- V_0_P
- V_0_N
- (near X100) DX_0_P
- (near X100) DX_0_N
- BANK13_LVDS_4_N
- BANK13_LVDS_6_P
- BANK13_LVDS_6_N
- (near X101) VCCO_13
- (near X101) BANK13_LVDS_5_N
- (near X101) BANK13_SE_0
- JX3
- Status/ Control Circuitry
- MGTREFCLKC0_P
- MGTREFCLKC0_N
- (near X102) MGTREFCLKC1_P
- (near X102) MGTREFCLKC1_N
- Enable Zed Board
- Enable Analog Circuitry
- MGTAVCC
- MGTTX0_P
- (near X102) GND
- (near X102) MGTRX0_P
- (near X102) MGTRX0_N
- (near X102) MGTRX1_P
- MGTRX0_N
- MGTTX1_P
- MGTTX1_N
- (near X102) MGTRX1_N
- (near X102) MGTRX2_P
- (near X102) MGTRX2_N
- MGTTX2_P
- MGTTX2_N
- MGTTX3_P
- MGTTX3_N
- (near X102) MGTRX3_P
- (near X102) MGTRX3_N
- (near X102) MGTAVCC
- (near X102) PS_MIO41
- PS_MIO42
- PS_MIO44
- PS_MIO46
- PS_MIO40
- (near X102) PS_MIO43
- (near X102) PS_MIO45
- (near X102) PS_MIO47
- (near X102) PS_MIO48
- (near X102) PS_MIO49
- Status LED
- Software Reset Button
- VCCO_13
- ETH_PHY_LED0
- ETH_MD1_P
- ETH_MD1_N
- (near X102) VCCO_13
- (near X102) ETH_PHY_LED1
- (near X102) ETH_MD2_P
- (near X102) ETH_MD2_N
- ETH_MD3_P
- ETH_MD3_N
- USB_ID
- (near X102) ETH_MD4_P
- (near X102) ETH_MD4_N
- (near X102) PS_MIO51
- Displays if PL is done configuring
- Series Resistor (240 R) exists on PicoZed Board
- Pull-Up resistor needs to be enabled in PL
- Debug Buttons
- USB_OTG_P
- USB_OTG_N
- BANK13_LVDS_7_P
- (near X102) PS_MIO50
- (near X102) USB_VBUS_OTG
- (near X102) USB_OTG_CPEN
- (near X102) BANK13_LVDS_8_P
- Overtemperature notfication of internal temperature sensor
- BANK13_LVDS_7_N
- BANK13_LVDS_9_P
- BANK13_LVDS_9_N
- (near X102) BANK13_LVDS_8_N
- (near X102) BANK13_LVDS_10_P
- (near X102) BANK13_LVDS_10_N
- Overtemperature notification of external temperature sensor
- (near X102) BANK13_LVDS_11_P
- (near X102) BANK13_LVDS_11_N
- (near X102) BANK13_LVDS_13_P
- (near X102) BANK13_LVDS_13_N
- (near X102) BANK13_LVDS_12_P
- (near X102) BANK13_LVDS_12_N
- (near X102) BANK13_LVDS_14_P
- (near X102) BANK13_LVDS_14_N
- End of range indicator
- (near X102) BANK13_LVDS_15_P
- (near X102) BANK13_LVDS_15_N
- (near X102) BANK13_LVDS_16_P
- (near X102) BANK13_LVDS_16_N
- End of range indicator if minimum gain is configured
- Debug LED
- (near TP182) Colour coding:
  - Purple = all PicoZed boards
  - Light Purple = only 7015/7020/7030
  - Dark Purple = only 7015/7030
- Project:
- Title:
- Size:
- Date:
- File:
- A2
- Project ID:
- Time:
- Sheet
- Version:
- of
- Variant:
- (in symbol LED_GREEN_GENERIC) green

### Library data of the parts
C100-C134 = C_GENERIC: Prometheus_ID: *; Prometheus_Manufacturer: *
  C100 C103 C106 C109 C112 C115 C118 C121 C124 C129 C132: Prometheus_ManPartNo: 2.2uF; Prometheus_Comment: 2.2uF; Prometheus_CurrentFootprint: C_1206_N [CAPC3216N IPC]
  C101 C104 C107 C110 C113 C116 C119 C122 C125 C130 C133: Prometheus_ManPartNo: 100nF; Prometheus_Comment: 100nF; Prometheus_CurrentFootprint: C_0805_N [CAPC2013N IPC]
  C102 C105 C108 C111 C114 C117 C120 C123 C126 C131 C134: Prometheus_ManPartNo: 100pF; Prometheus_Comment: 100pF; Prometheus_CurrentFootprint: C_0603_N [CAPC1608N IPC]
  C127 C128: Prometheus_ManPartNo: 100nF; Prometheus_Comment: 100nF; Prometheus_CurrentFootprint: C_0603_N [CAPC1608N IPC]
D100-D106 = LED_GREEN_GENERIC: Prometheus_Manufacturer: Lite-On Inc.; Prometheus_ID: *; Prometheus_ManPartNo: LTST-C191KGKT; Prometheus_Comment: LTST-C191KGKT; Prometheus_CurrentFootprint: LED_0603-GREEN_N_AK; ComponentLink1Description: Datasheet; ComponentLink1URL: https://optoelectronics.liteon.com/upload/download/DS22-2000-228/LTST-C191KGKT.PDF
IC100 IC101 = IC_NC7WZ07P6X: UHS Dual Buffer / Open-Drain Outputs / Vcc: 1.65 V to 5.50 V / Power Down High-Impedance Inputs / Outputs; Prometheus_Manufacturer: ON Semiconductor; Prometheus_ManPartNo: NC7WZ07P6X; Prometheus_Comment: NC7WZ07P6X; Prometheus_CurrentFootprint: TSOP65P210X110-6N IPC
R100-R111 = R_GENERIC_DIN: Prometheus_ID: *; Prometheus_Manufacturer: *
  R100-R103 R105: Prometheus_ManPartNo: 10K; Prometheus_Comment: 10K; Prometheus_CurrentFootprint: R_0603_N [RESC1608N IPC]
  R104: Prometheus_ManPartNo: 40R2; Prometheus_Comment: 40R2; Prometheus_CurrentFootprint: R_0603_M [RESC1608M IPC]
  R106-R111: Prometheus_ManPartNo: 240R; Prometheus_Comment: 240R; Prometheus_CurrentFootprint: R_0603_N [RESC1608N IPC]
SW100-SW103 = SW_430152070826: WS-TASV SMT Tactile Switch / Height: 4.6 mm / Actuating Force: 160g; Prometheus_Manufacturer: Wuerth Electronics; Prometheus_ID: *; Prometheus_ManPartNo: 430152070826; Prometheus_Comment: 430152070826; Prometheus_CurrentFootprint: SW_430152070826
T100 = T_NMOS_BSS138-7-F: VDS = 50 V / VDG = 50 V / VGS = +-20 V / ID = 200 mA / VGS_th = typ. 1.2 V / RDS_on = typ. 1.4 OHM; Prometheus_Manufacturer: Diodes Incorporated; Prometheus_ID: *; Prometheus_ManPartNo: BSS138-7-F; Prometheus_Comment: BSS138-7-F; Prometheus_CurrentFootprint: SOT105P235X102-3N IPC; ComponentLink1Description: Datasheet; ComponentLink1URL: https://www.diodes.com/assets/Datasheets/ds30144.pdf
TP100-TP182 = TP_GENERIC: Needle Test Point; Prometheus_ID: *; Prometheus_ManPartNo: TP_GENERIC; Prometheus_Manufacturer: *; Prometheus_Comment: TP_GENERIC; Prometheus_CurrentFootprint: TP_0.8_P100T
X100-X102 = X_61083-104400LF: BergStak® 0.80mm Pitch / Mezzanine Connector / Vertical Header / Double Row / 100 Positions / Height: 7.7mm; Prometheus_Manufacturer: Amphenol ICC; Prometheus_ID: *; Prometheus_ManPartNo: 61083-104400LF; Prometheus_Comment: 61083-104400LF; Prometheus_CurrentFootprint: X_61083-104400LF

## Sheet PowerSupply.SchDoc: Power Supply
size A2; DrawnBy: Patrik Staudenmayer; DocumentNumber: 4; SheetNumber: 4; SheetTotal: 15
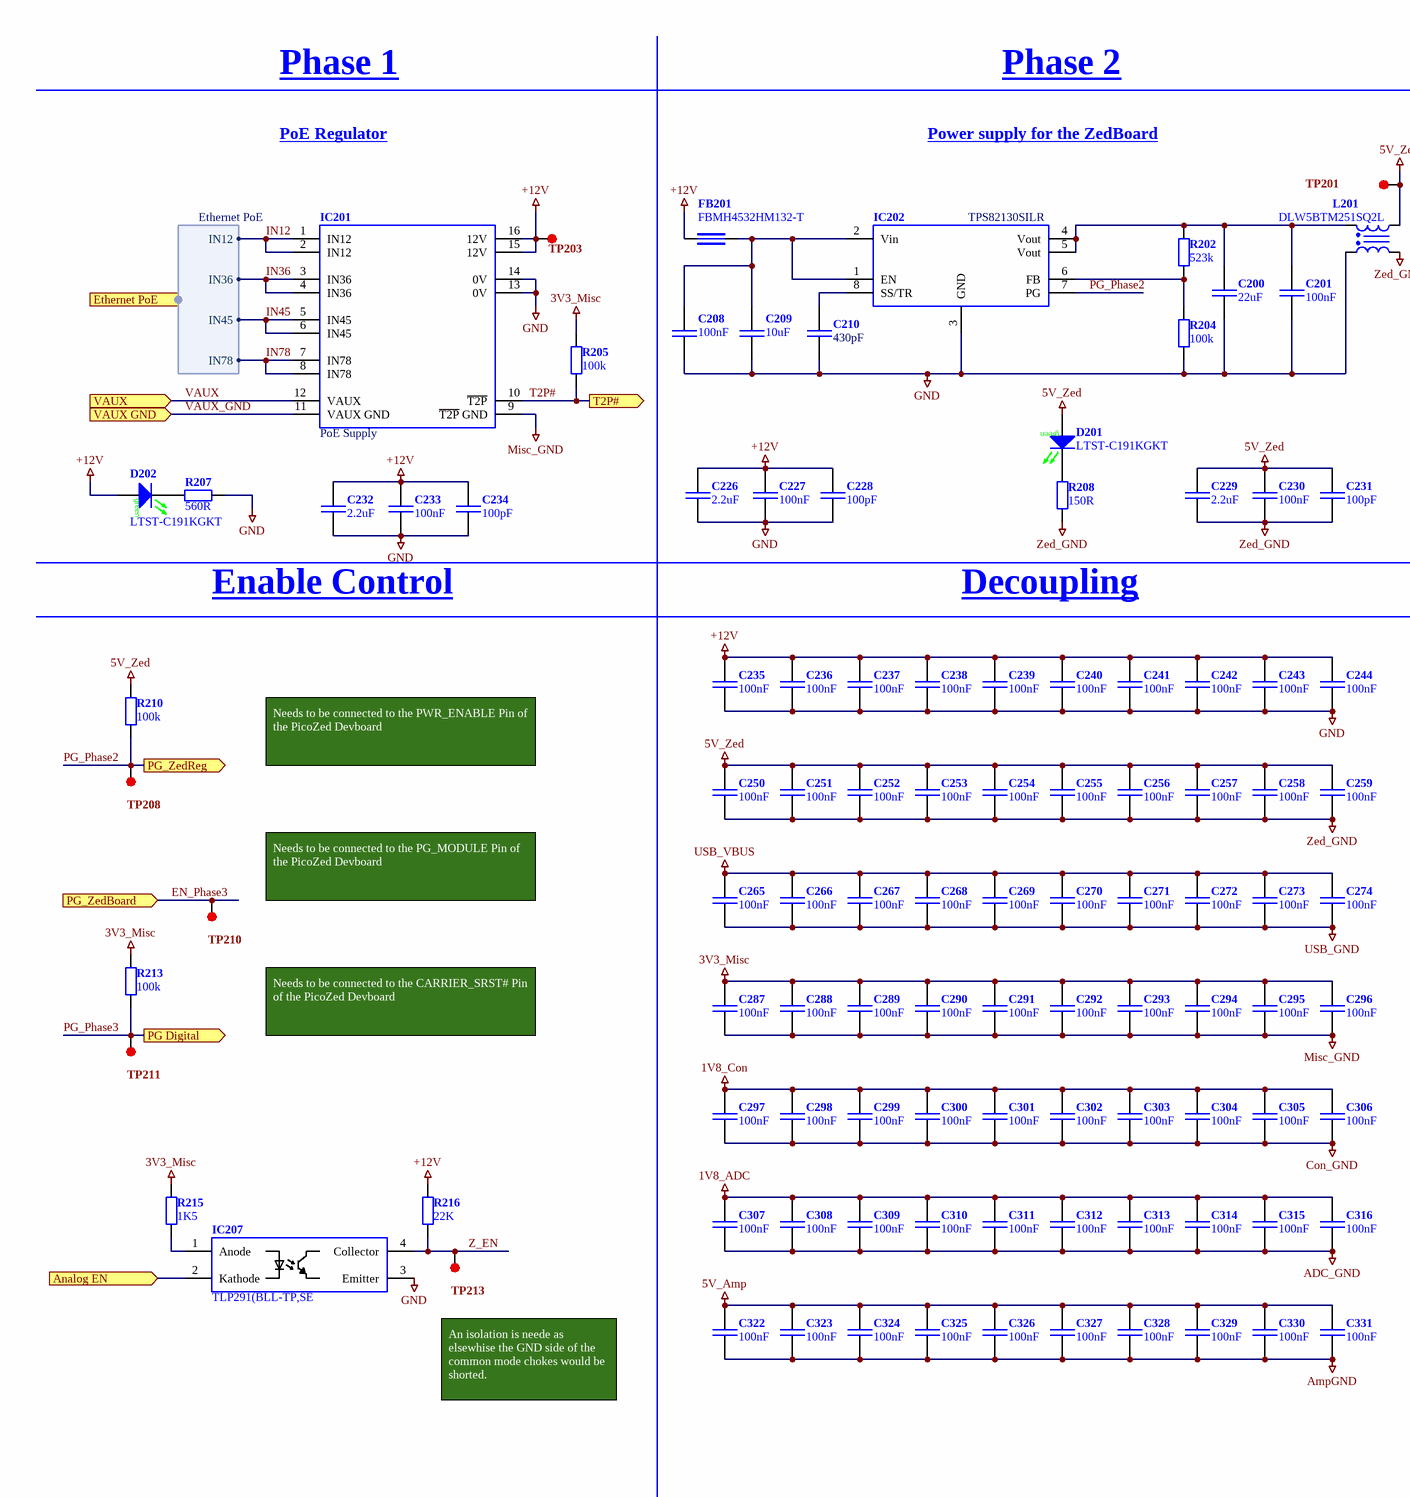
[diagram p4: PowerSupply.SchDoc, left]
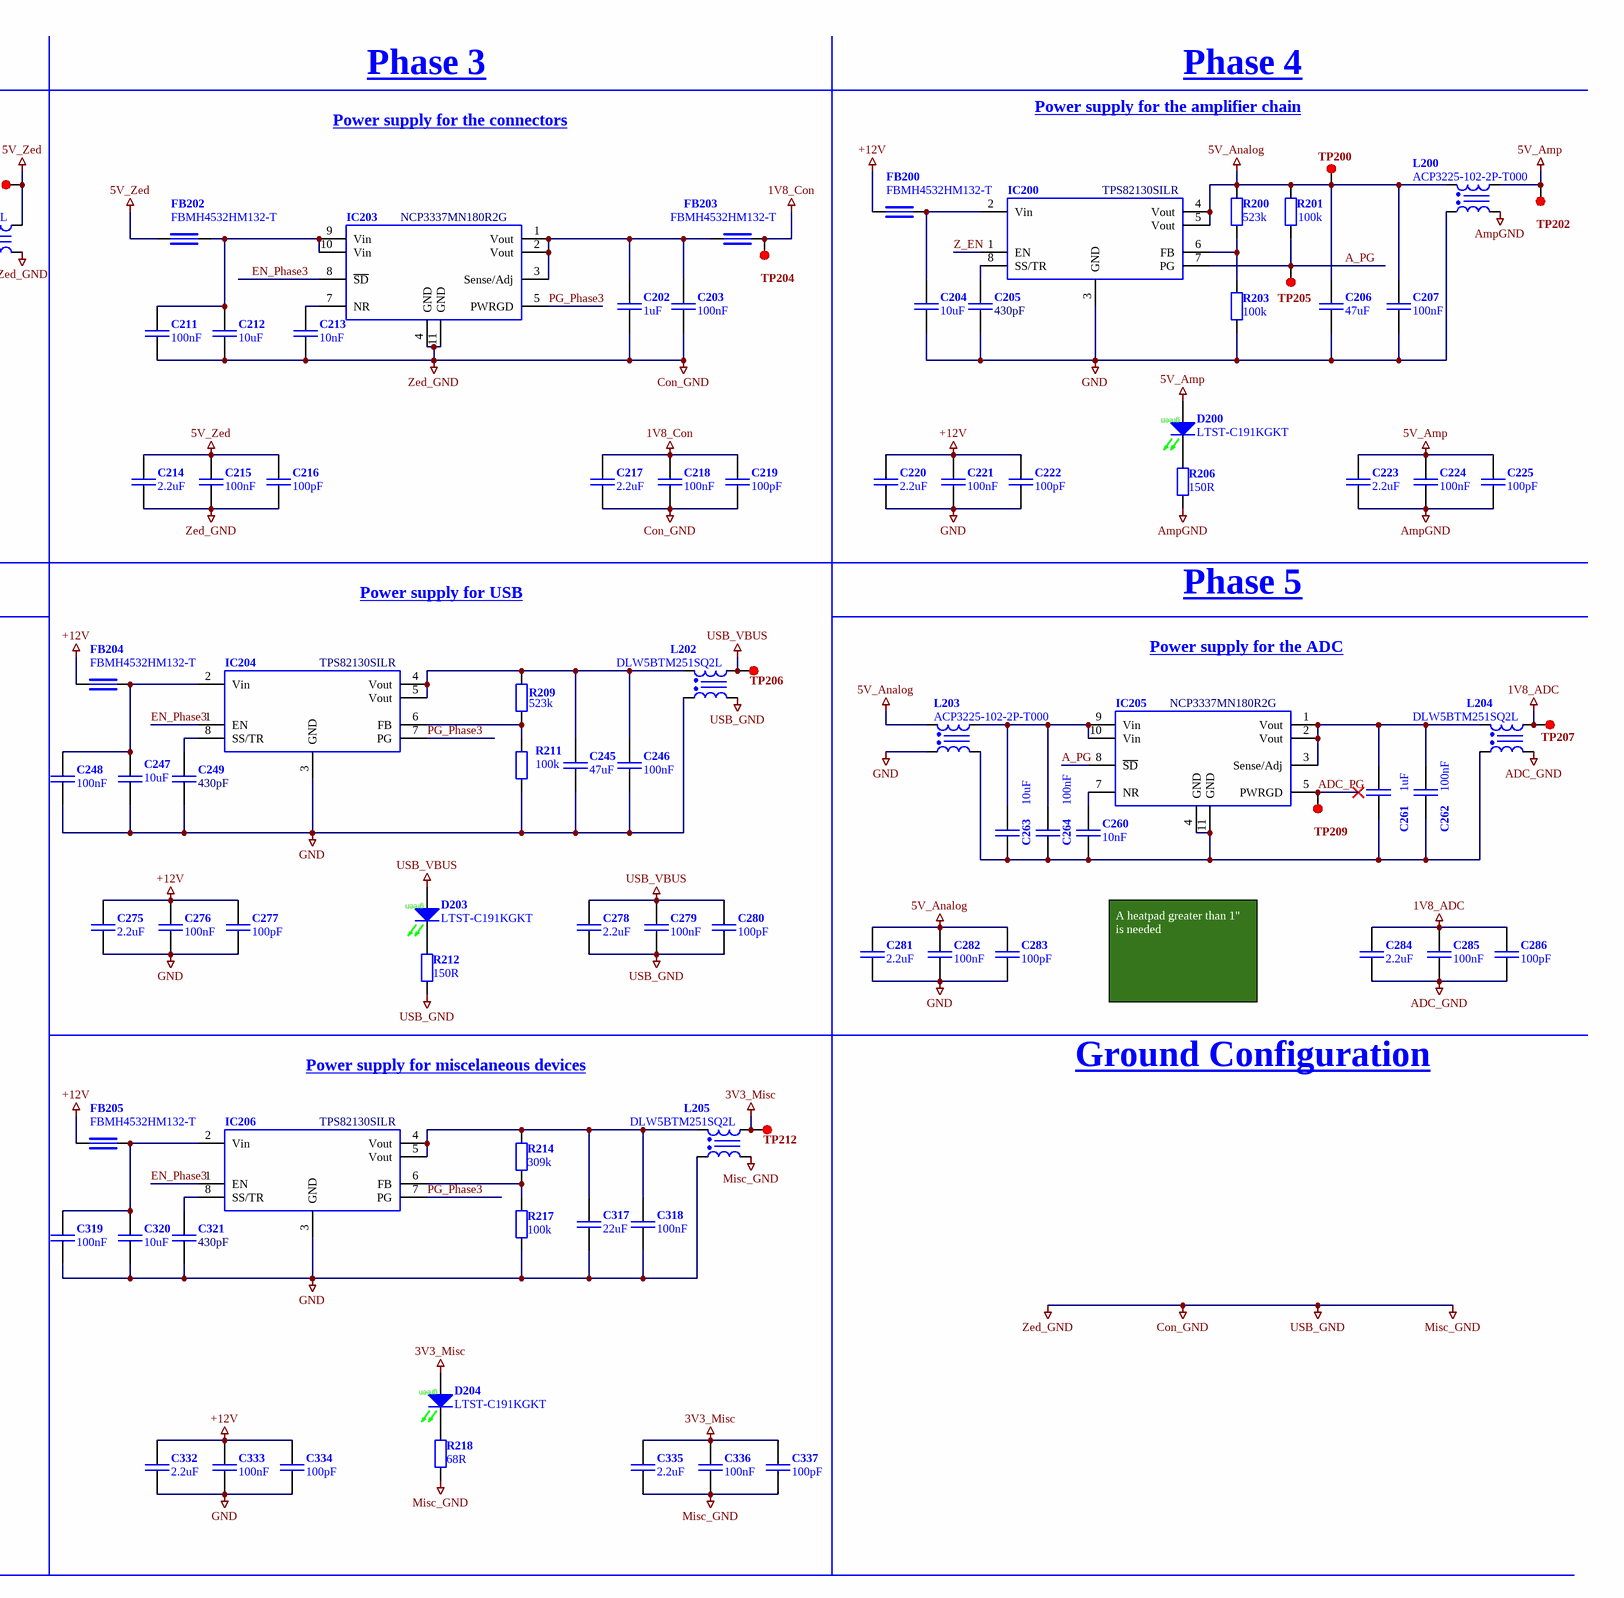
[diagram p5: PowerSupply.SchDoc, right]

### Parts
C200  22uF  [C_0805_N [CAPC2013N IPC]]
C201  100nF  [C_0603_N [CAPC1608N IPC]]
C202  1uF  [C_0603_N [CAPC1608N IPC]]
C203  100nF  [C_0603_N [CAPC1608N IPC]]
C204  10uF  [C_1210_N [CAPC3225N IPC]]
C205  430pF  [C_0603_N [CAPC1608N IPC]]
C206  47uF  [C_0805_N [CAPC2013N IPC]]
C207  100nF  [C_0603_N [CAPC1608N IPC]]
C208  100nF  [C_0603_N [CAPC1608N IPC]]
C209  10uF  [C_1210_N [CAPC3225N IPC]]
C210  430pF  [C_0603_N [CAPC1608N IPC]]
C211  100nF  [C_0603_N [CAPC1608N IPC]]
C212  10uF  [C_0603_N [CAPC1608N IPC]]
C213  10nF  [C_0603_N [CAPC1608N IPC]]
C214  2.2uF  [C_1206_N [CAPC3216N IPC]]
C215  100nF  [C_0805_N [CAPC2013N IPC]]
C216  100pF  [C_0603_N [CAPC1608N IPC]]
C217  2.2uF  [C_1206_N [CAPC3216N IPC]]
C218  100nF  [C_0805_N [CAPC2013N IPC]]
C219  100pF  [C_0603_N [CAPC1608N IPC]]
C220  2.2uF  [C_1206_N [CAPC3216N IPC]]
C221  100nF  [C_0805_N [CAPC2013N IPC]]
C222  100pF  [C_0603_N [CAPC1608N IPC]]
C223  2.2uF  [C_1206_N [CAPC3216N IPC]]
C224  100nF  [C_0805_N [CAPC2013N IPC]]
C225  100pF  [C_0603_N [CAPC1608N IPC]]
C226  2.2uF  [C_1206_N [CAPC3216N IPC]]
C227  100nF  [C_0805_N [CAPC2013N IPC]]
C228  100pF  [C_0603_N [CAPC1608N IPC]]
C229  2.2uF  [C_1206_N [CAPC3216N IPC]]
C230  100nF  [C_0805_N [CAPC2013N IPC]]
C231  100pF  [C_0603_N [CAPC1608N IPC]]
C232  2.2uF  [C_1206_N [CAPC3216N IPC]]
C233  100nF  [C_0805_N [CAPC2013N IPC]]
C234  100pF  [C_0603_N [CAPC1608N IPC]]
C235  100nF  [C_0603_N [CAPC1608N IPC]]
C236  100nF  [C_0603_N [CAPC1608N IPC]]
C237  100nF  [C_0603_N [CAPC1608N IPC]]
C238  100nF  [C_0603_N [CAPC1608N IPC]]
C239  100nF  [C_0603_N [CAPC1608N IPC]]
C240  100nF  [C_0603_N [CAPC1608N IPC]]
C241  100nF  [C_0603_N [CAPC1608N IPC]]
C242  100nF  [C_0603_N [CAPC1608N IPC]]
C243  100nF  [C_0603_N [CAPC1608N IPC]]
C244  100nF  [C_0603_N [CAPC1608N IPC]]
C245  47uF  [C_0603_N [CAPC1608N IPC]]
C246  100nF  [C_0603_N [CAPC1608N IPC]]
C247  10uF  [C_1210_N [CAPC3225N IPC]]
C248  100nF  [C_0603_N [CAPC1608N IPC]]
C249  430pF  [C_0603_N [CAPC1608N IPC]]
C250  100nF  [C_0603_N [CAPC1608N IPC]]
C251  100nF  [C_0603_N [CAPC1608N IPC]]
C252  100nF  [C_0603_N [CAPC1608N IPC]]
C253  100nF  [C_0603_N [CAPC1608N IPC]]
C254  100nF  [C_0603_N [CAPC1608N IPC]]
C255  100nF  [C_0603_N [CAPC1608N IPC]]
C256  100nF  [C_0603_N [CAPC1608N IPC]]
C257  100nF  [C_0603_N [CAPC1608N IPC]]
C258  100nF  [C_0603_N [CAPC1608N IPC]]
C259  100nF  [C_0603_N [CAPC1608N IPC]]
C260  10nF  [C_0603_N [CAPC1608N IPC]]
C261  1uF  [C_0603_N [CAPC1608N IPC]]
C262  100nF  [C_0603_N [CAPC1608N IPC]]
C263  10uF  [C_0603_N [CAPC1608N IPC]]
C264  100nF  [C_0603_N [CAPC1608N IPC]]
C265  100nF  [C_0603_N [CAPC1608N IPC]]
C266  100nF  [C_0603_N [CAPC1608N IPC]]
C267  100nF  [C_0603_N [CAPC1608N IPC]]
C268  100nF  [C_0603_N [CAPC1608N IPC]]
C269  100nF  [C_0603_N [CAPC1608N IPC]]
C270  100nF  [C_0603_N [CAPC1608N IPC]]
C271  100nF  [C_0603_N [CAPC1608N IPC]]
C272  100nF  [C_0603_N [CAPC1608N IPC]]
C273  100nF  [C_0603_N [CAPC1608N IPC]]
C274  100nF  [C_0603_N [CAPC1608N IPC]]
C275  2.2uF  [C_1206_N [CAPC3216N IPC]]
C276  100nF  [C_0805_N [CAPC2013N IPC]]
C277  100pF  [C_0603_N [CAPC1608N IPC]]
C278  2.2uF  [C_1206_N [CAPC3216N IPC]]
C279  100nF  [C_0805_N [CAPC2013N IPC]]
C280  100pF  [C_0603_N [CAPC1608N IPC]]
C281  2.2uF  [C_1206_N [CAPC3216N IPC]]
C282  100nF  [C_0805_N [CAPC2013N IPC]]
C283  100pF  [C_0603_N [CAPC1608N IPC]]
C284  2.2uF  [C_1206_N [CAPC3216N IPC]]
C285  100nF  [C_0805_N [CAPC2013N IPC]]
C286  100pF  [C_0603_N [CAPC1608N IPC]]
C287  100nF  [C_0603_N [CAPC1608N IPC]]
C288  100nF  [C_0603_N [CAPC1608N IPC]]
C289  100nF  [C_0603_N [CAPC1608N IPC]]
C290  100nF  [C_0603_N [CAPC1608N IPC]]
C291  100nF  [C_0603_N [CAPC1608N IPC]]
C292  100nF  [C_0603_N [CAPC1608N IPC]]
C293  100nF  [C_0603_N [CAPC1608N IPC]]
C294  100nF  [C_0603_N [CAPC1608N IPC]]
C295  100nF  [C_0603_N [CAPC1608N IPC]]
C296  100nF  [C_0603_N [CAPC1608N IPC]]
C297  100nF  [C_0603_N [CAPC1608N IPC]]
C298  100nF  [C_0603_N [CAPC1608N IPC]]
C299  100nF  [C_0603_N [CAPC1608N IPC]]
C300  100nF  [C_0603_N [CAPC1608N IPC]]
C301  100nF  [C_0603_N [CAPC1608N IPC]]
C302  100nF  [C_0603_N [CAPC1608N IPC]]
C303  100nF  [C_0603_N [CAPC1608N IPC]]
C304  100nF  [C_0603_N [CAPC1608N IPC]]
C305  100nF  [C_0603_N [CAPC1608N IPC]]
C306  100nF  [C_0603_N [CAPC1608N IPC]]
C307  100nF  [C_0603_N [CAPC1608N IPC]]
C308  100nF  [C_0603_N [CAPC1608N IPC]]
C309  100nF  [C_0603_N [CAPC1608N IPC]]
C310  100nF  [C_0603_N [CAPC1608N IPC]]
C311  100nF  [C_0603_N [CAPC1608N IPC]]
C312  100nF  [C_0603_N [CAPC1608N IPC]]
C313  100nF  [C_0603_N [CAPC1608N IPC]]
C314  100nF  [C_0603_N [CAPC1608N IPC]]
C315  100nF  [C_0603_N [CAPC1608N IPC]]
C316  100nF  [C_0603_N [CAPC1608N IPC]]
C317  22uF  [C_0805_N [CAPC2013N IPC]]
C318  100nF  [C_0603_N [CAPC1608N IPC]]
C319  100nF  [C_0603_N [CAPC1608N IPC]]
C320  10uF  [C_1210_N [CAPC3225N IPC]]
C321  430pF  [C_0603_N [CAPC1608N IPC]]
C322  100nF  [C_0603_N [CAPC1608N IPC]]
C323  100nF  [C_0603_N [CAPC1608N IPC]]
C324  100nF  [C_0603_N [CAPC1608N IPC]]
C325  100nF  [C_0603_N [CAPC1608N IPC]]
C326  100nF  [C_0603_N [CAPC1608N IPC]]
C327  100nF  [C_0603_N [CAPC1608N IPC]]
C328  100nF  [C_0603_N [CAPC1608N IPC]]
C329  100nF  [C_0603_N [CAPC1608N IPC]]
C330  100nF  [C_0603_N [CAPC1608N IPC]]
C331  100nF  [C_0603_N [CAPC1608N IPC]]
C332  2.2uF  [C_1206_N [CAPC3216N IPC]]
C333  100nF  [C_0805_N [CAPC2013N IPC]]
C334  100pF  [C_0603_N [CAPC1608N IPC]]
C335  2.2uF  [C_1206_N [CAPC3216N IPC]]
C336  100nF  [C_0805_N [CAPC2013N IPC]]
C337  100pF  [C_0603_N [CAPC1608N IPC]]
D200  LTST-C191KGKT  [LED_0603-GREEN_N_AK]
D201  LTST-C191KGKT  [LED_0603-GREEN_N_AK]
D202  LTST-C191KGKT  [LED_0603-GREEN_N_AK]
D203  LTST-C191KGKT  [LED_0603-GREEN_N_AK]
D204  LTST-C191KGKT  [LED_0603-GREEN_N_AK]
FB200  FBMH4532HM132-T  [L_1812_N [INDC4532X25N IPC]]
FB201  FBMH4532HM132-T  [L_1812_N [INDC4532X25N IPC]]
FB202  FBMH4532HM132-T  [L_1812_N [INDC4532X25N IPC]]
FB203  FBMH4532HM132-T  [L_1812_N [INDC4532X25N IPC]]
FB204  FBMH4532HM132-T  [L_1812_N [INDC4532X25N IPC]]
FB205  FBMH4532HM132-T  [L_1812_N [INDC4532X25N IPC]]
IC200  TPS82130SILR  [SIL0008D]
IC201  PoE Supply  [SREG_PoE_PowerSupply Prometheus]
IC202  TPS82130SILR  [SIL0008D]
IC203  NCP3337MN180R2G  [SON50P300X100_HS-11N]
IC204  TPS82130SILR  [SIL0008D]
IC205  NCP3337MN180R2G  [SON50P300X100_HS-11N]
IC206  TPS82130SILR  [SIL0008D]
IC207  TLP291(BLL-TP,SE  [SOP127P700X220-4N]
L200  ACP3225-102-2P-T000  [L_ACP3225-102-2P-T000]
L201  DLW5BTM251SQ2L  [L_COMMON_DLW5BTM251SQ2L Prometheus]
L202  DLW5BTM251SQ2L  [L_COMMON_DLW5BTM251SQ2L Prometheus]
L203  ACP3225-102-2P-T000  [L_ACP3225-102-2P-T000]
L204  DLW5BTM251SQ2L  [L_COMMON_DLW5BTM251SQ2L Prometheus]
L205  DLW5BTM251SQ2L  [L_COMMON_DLW5BTM251SQ2L Prometheus]
R200  523k  [R_0603_N [RESC1608N IPC]]
R201  100k  [R_0603_N [RESC1608N IPC]]
R202  523k  [R_0603_N [RESC1608N IPC]]
R203  100k  [R_0603_N [RESC1608N IPC]]
R204  100k  [R_0603_N [RESC1608N IPC]]
R205  100k  [R_0603_N [RESC1608N IPC]]
R206  150R  [R_0603_N [RESC1608N IPC]]
R207  560R  [R_0603_N [RESC1608N IPC]]
R208  150R  [R_0603_N [RESC1608N IPC]]
R209  523k  [R_0603_N [RESC1608N IPC]]
R210  100k  [R_0603_N [RESC1608N IPC]]
R211  100k  [R_0603_N [RESC1608N IPC]]
R212  150R  [R_0603_N [RESC1608N IPC]]
R213  100k  [R_0603_N [RESC1608N IPC]]
R214  309k  [R_0603_N [RESC1608N IPC]]
R215  1K5  [R_0603_N [RESC1608N IPC]]
R216  22K  [R_0603_N [RESC1608N IPC]]
R217  100k  [R_0603_N [RESC1608N IPC]]
R218  68R  [R_0603_N [RESC1608N IPC]]
TP200  TP_GENERIC  [TP_0.8_P100T]  (value not drawn)  (no BOM)
TP201  TP_GENERIC  [TP_0.8_P100T]  (value not drawn)  (no BOM)
TP202  TP_GENERIC  [TP_0.8_P100T]  (value not drawn)  (no BOM)
TP203  TP_GENERIC  [TP_0.8_P100T]  (value not drawn)  (no BOM)
TP204  TP_GENERIC  [TP_0.8_P100T]  (value not drawn)  (no BOM)
TP205  TP_GENERIC  [TP_0.8_P100T]  (value not drawn)  (no BOM)
TP206  TP_GENERIC  [TP_0.8_P100T]  (value not drawn)  (no BOM)
TP207  TP_GENERIC  [TP_0.8_P100T]  (value not drawn)  (no BOM)
TP208  TP_GENERIC  [TP_0.8_P100T]  (value not drawn)  (no BOM)
TP209  TP_GENERIC  [TP_0.8_P100T]  (value not drawn)  (no BOM)
TP210  TP_GENERIC  [TP_0.8_P100T]  (value not drawn)  (no BOM)
TP211  TP_GENERIC  [TP_0.8_P100T]  (value not drawn)  (no BOM)
TP212  TP_GENERIC  [TP_0.8_P100T]  (value not drawn)  (no BOM)
TP213  TP_GENERIC  [TP_0.8_P100T]  (value not drawn)  (no BOM)

### Ports
Analog EN (in), Ethernet PoE (harness Ethernet PoE), PG Digital (out), PG_ZedBoard (in), PG_ZedReg (out), T2P# (out), VAUX (in), VAUX GND (in)

### Harnesses
Ethernet PoE: IN12, IN36, IN45, IN78

### Nets
1V8_ADC: C284.1 C285.1 C286.1 C307.1 C308.1 C309.1 C310.1 C311.1 C312.1 C313.1 C314.1 C315.1 C316.1 L204.3 TP207.1
1V8_Con: C217.1 C218.1 C219.1 C297.1 C298.1 C299.1 C300.1 C301.1 C302.1 C303.1 C304.1 C305.1 C306.1 FB203.1 TP204.1
3V3_Misc: C287.1 C288.1 C289.1 C290.1 C291.1 C292.1 C293.1 C294.1 C295.1 C296.1 C335.1 C336.1 C337.1 D204.A L205.3 R205.2 R213.2 R215.1 TP212.1
5V_Amp: C223.1 C224.1 C225.1 C322.1 C323.1 C324.1 C325.1 C326.1 C327.1 C328.1 C329.1 C330.1 C331.1 D200.A L200.3 TP202.1
5V_Analog: C206.1 C207.1 C281.1 C282.1 C283.1 IC200.4(Vout) IC200.5(Vout) L200.2 L203.2 R200.2 R201.2 TP200.1
5V_Zed: C214.1 C215.1 C216.1 C229.1 C230.1 C231.1 C250.1 C251.1 C252.1 C253.1 C254.1 C255.1 C256.1 C257.1 C258.1 C259.1 D201.A FB202.2 L201.3 R210.2 TP201.1
+12V: C220.1 C221.1 C222.1 C226.1 C227.1 C228.1 C232.1 C233.1 C234.1 C235.1 C236.1 C237.1 C238.1 C239.1 C240.1 C241.1 C242.1 C243.1 C244.1 C275.1 C276.1 C277.1 C332.1 C333.1 C334.1 D202.A FB200.2 FB201.2 FB204.2 FB205.2 IC201.15(12V) IC201.16(12V) R216.1 TP203.1
ADC_GND: C284.2 C285.2 C286.2 C307.2 C308.2 C309.2 C310.2 C311.2 C312.2 C313.2 C314.2 C315.2 C316.2 L204.2
AmpGND: C223.2 C224.2 C225.2 C322.2 C323.2 C324.2 C325.2 C326.2 C327.2 C328.2 C329.2 C330.2 C331.2 L200.4 R206.1
Con_GND: C202.2 C203.2 C211.2 C212.2 C213.2 C214.2 C215.2 C216.2 C217.2 C218.2 C219.2 C229.2 C230.2 C231.2 C250.2 C251.2 C252.2 C253.2 C254.2 C255.2 C256.2 C257.2 C258.2 C259.2 C265.2 C266.2 C267.2 C268.2 C269.2 C270.2 C271.2 C272.2 C273.2 C274.2 C278.2 C279.2 C280.2 C287.2 C288.2 C289.2 C290.2 C291.2 C292.2 C293.2 C294.2 C295.2 C296.2 C297.2 C298.2 C299.2 C300.2 C301.2 C302.2 C303.2 C304.2 C305.2 C306.2 C335.2 C336.2 C337.2 IC201.9(~{T2P}_GND) IC203.4(GND) IC203.11(GND) L201.2 L202.2 L205.2 R208.1 R212.1 R218.1  [also labelled Misc_GND, USB_GND, Zed_GND]
GND: C200.2 C201.2 C204.2 C205.2 C206.2 C207.2 C208.2 C209.2 C210.2 C220.2 C221.2 C222.2 C226.2 C227.2 C228.2 C232.2 C233.2 C234.2 C235.2 C236.2 C237.2 C238.2 C239.2 C240.2 C241.2 C242.2 C243.2 C244.2 C245.2 C246.2 C247.2 C248.2 C249.2 C275.2 C276.2 C277.2 C281.2 C282.2 C283.2 C317.2 C318.2 C319.2 C320.2 C321.2 C332.2 C333.2 C334.2 IC200.3(GND) IC201.13(0V) IC201.14(0V) IC202.3(GND) IC204.3(GND) IC206.3(GND) IC207.3(Emitter) L200.1 L201.1 L202.1 L203.1 L205.1 R203.1 R204.1 R207.1 R211.1 R217.1
USB_VBUS: C265.1 C266.1 C267.1 C268.1 C269.1 C270.1 C271.1 C272.1 C273.1 C274.1 C278.1 C279.1 C280.1 D203.A L202.3 TP206.1
A_PG: IC200.7(PG) IC205.8(~{SD}) R201.1 TP205.1
ADC_PG: IC205.5(PWRGD) TP209.1
EN_Phase3: IC203.8(~{SD}) IC204.1(EN) IC206.1(EN) TP210.1 ; port PG_ZedBoard
IN12: IC201.1(IN12) IC201.2(IN12) ; port Ethernet PoE.IN12
IN36: IC201.3(IN36) IC201.4(IN36) ; port Ethernet PoE.IN36
IN45: IC201.5(IN45) IC201.6(IN45) ; port Ethernet PoE.IN45
IN78: IC201.7(IN78) IC201.8(IN78) ; port Ethernet PoE.IN78
PG_Phase2: IC202.7(PG) R210.1 TP208.1 ; port PG_ZedReg
PG_Phase3: IC203.5(PWRGD) IC204.7(PG) IC206.7(PG) R213.1 TP211.1 ; port PG Digital
T2P#: IC201.10(~{T2P}) R205.1 ; port T2P#
VAUX: IC201.12(VAUX) ; port VAUX
VAUX_GND: IC201.11(VAUX_GND) ; port VAUX GND
Z_EN: IC200.1(EN) IC207.4(Collector) R216.2 TP213.1
NetC200_1: C200.1 C201.1 IC202.4(Vout) IC202.5(Vout) L201.4 R202.2
NetC202_1: C202.1 C203.1 FB203.2 IC203.1(Vout) IC203.2(Vout) IC203.3(Sense/Adj)
NetC204_1: C204.1 FB200.1 IC200.2(Vin)
NetC205_1: C205.1 IC200.8(SS/TR)
NetC208_1: C208.1 C209.1 FB201.1 IC202.1(EN) IC202.2(Vin)
NetC210_1: C210.1 IC202.8(SS/TR)
NetC211_1: C211.1 C212.1 FB202.1 IC203.9(Vin) IC203.10(Vin)
NetC213_1: C213.1 IC203.7(NR)
NetC245_1: C245.1 C246.1 IC204.4(Vout) IC204.5(Vout) L202.4 R209.2
NetC247_1: C247.1 C248.1 FB204.1 IC204.2(Vin)
NetC249_1: C249.1 IC204.8(SS/TR)
NetC260_1: C260.1 IC205.7(NR)
NetC260_2: C260.2 C261.2 C262.2 C263.2 C264.2 IC205.4(GND) IC205.11(GND) L203.4 L204.1
NetC261_1: C261.1 C262.1 IC205.1(Vout) IC205.2(Vout) IC205.3(Sense/Adj) L204.4
NetC263_1: C263.1 C264.1 IC205.9(Vin) IC205.10(Vin) L203.3
NetC317_1: C317.1 C318.1 IC206.4(Vout) IC206.5(Vout) L205.4 R214.2
NetC319_1: C319.1 C320.1 FB205.1 IC206.2(Vin)
NetC321_1: C321.1 IC206.8(SS/TR)
NetD200_K: D200.K R206.2
NetD201_K: D201.K R208.2
NetD202_K: D202.K R207.2
NetD203_K: D203.K R212.2
NetD204_K: D204.K R218.2
NetIC200_6: IC200.6(FB) R200.1 R203.2
NetIC202_6: IC202.6(FB) R202.1 R204.2
NetIC204_6: IC204.6(FB) R209.1 R211.2
NetIC206_6: IC206.6(FB) R214.1 R217.2
NetIC207_1: IC207.1(Anode) R215.2
NetIC207_2: IC207.2(Kathode) ; port Analog EN

### Notes on the sheet
- Phase 1
- Phase 2
- Phase 3
- Power supply for the amplifier chain
- Phase 4
- PoE Regulator
- Power supply for the ZedBoard
- Power supply for the connectors
- Enable Control
- Decoupling
- Power supply for USB
- Power supply for the ADC
- Phase 5
- Needs to be connected to the PWR_ENABLE Pin of the PicoZed Devboard
- Needs to be connected to the PG_MODULE Pin of the PicoZed Devboard
- Needs to be connected to the CARRIER_SRST# Pin of the PicoZed Devboard
- A heatpad greater than 1" is needed
- Power supply for miscelaneous devices
- Ground Configuration
- An isolation is neede as elsewhise the GND side of the common mode chokes would be shorted.
- Project:
- Title:
- Size:
- Date:
- File:
- A2
- Project ID:
- Time:
- Sheet
- Version:
- of
- Variant:
- (in symbol LED_GREEN_GENERIC) green

### Library data of the parts
C200-C337 = C_GENERIC: Prometheus_ID: *; Prometheus_Manufacturer: *
  C200 C317: Prometheus_ManPartNo: 22uF; Prometheus_Comment: 22uF; Prometheus_CurrentFootprint: C_0805_N [CAPC2013N IPC]
  C201 C203 C207 C208 C211 C235-C244 C246 C248 C250-C259 C262 C264-C274 C287-C316 C318 C319 C322-C331: Prometheus_ManPartNo: 100nF; Prometheus_Comment: 100nF; Prometheus_CurrentFootprint: C_0603_N [CAPC1608N IPC]
  C202 C261: Prometheus_ManPartNo: 1uF; Prometheus_Comment: 1uF; Prometheus_CurrentFootprint: C_0603_N [CAPC1608N IPC]
  C204 C209 C247 C320: Prometheus_ManPartNo: 10uF; Prometheus_Comment: 10uF; Prometheus_CurrentFootprint: C_1210_N [CAPC3225N IPC]
  C205 C210 C249 C321: Prometheus_ManPartNo: 430pF; Prometheus_Comment: 430pF; Prometheus_CurrentFootprint: C_0603_N [CAPC1608N IPC]
  C206: Prometheus_ManPartNo: 47uF; Prometheus_Comment: 47uF; Prometheus_CurrentFootprint: C_0805_N [CAPC2013N IPC]
  C212 C263: Prometheus_ManPartNo: 10uF; Prometheus_Comment: 10uF; Prometheus_CurrentFootprint: C_0603_N [CAPC1608N IPC]
  C213 C260: Prometheus_ManPartNo: 10nF; Prometheus_Comment: 10nF; Prometheus_CurrentFootprint: C_0603_N [CAPC1608N IPC]
  C214 C217 C220 C223 C226 C229 C232 C275 C278 C281 C284 C332 C335: Prometheus_ManPartNo: 2.2uF; Prometheus_Comment: 2.2uF; Prometheus_CurrentFootprint: C_1206_N [CAPC3216N IPC]
  C215 C218 C221 C224 C227 C230 C233 C276 C279 C282 C285 C333 C336: Prometheus_ManPartNo: 100nF; Prometheus_Comment: 100nF; Prometheus_CurrentFootprint: C_0805_N [CAPC2013N IPC]
  C216 C219 C222 C225 C228 C231 C234 C277 C280 C283 C286 C334 C337: Prometheus_ManPartNo: 100pF; Prometheus_Comment: 100pF; Prometheus_CurrentFootprint: C_0603_N [CAPC1608N IPC]
  C245: Prometheus_ManPartNo: 47uF; Prometheus_Comment: 47uF; Prometheus_CurrentFootprint: C_0603_N [CAPC1608N IPC]
D200-D204 = LED_GREEN_GENERIC: Prometheus_Manufacturer: Lite-On Inc.; Prometheus_ID: *; Prometheus_ManPartNo: LTST-C191KGKT; Prometheus_Comment: LTST-C191KGKT; Prometheus_CurrentFootprint: LED_0603-GREEN_N_AK; ComponentLink1Description: Datasheet; ComponentLink1URL: https://optoelectronics.liteon.com/upload/download/DS22-2000-228/LTST-C191KGKT.PDF
FB200-FB205 = FB_FBMH4532HM132-T: 1,3 kOHM @ 100 MHz / 3 A / 60 mOHM; Prometheus_Manufacturer: Taiyo Yuden; Prometheus_ID: *; Prometheus_ManPartNo: FBMH4532HM132-T; Prometheus_Comment: FBMH4532HM132-T; Prometheus_CurrentFootprint: L_1812_N [INDC4532X25N IPC]
IC200 IC202 IC204 IC206 = SREG_TPS82130SILR: Step-Down DC/DC / Vin = 4 V to 17 V / Vout = 0.9 V to 6 V Adjustable / Iout = 3 A; Prometheus_Manufacturer: Texas Instruments; Prometheus_ManPartNo: TPS82130SILR; Prometheus_Comment: TPS82130SILR; Prometheus_CurrentFootprint: SIL0008D
IC201 = SREG_PoE_PowerSupply: Prometheus_Manufacturer: Prometheus; Prometheus_ManPartNo: PoE Supply; Prometheus_Comment: PoE Supply; Prometheus_CurrentFootprint: SREG_PoE_PowerSupply Prometheus
IC203 IC205 = LDO_NCP3337: LDO / Vin max. 16 V / Vout 1V8; Prometheus_Manufacturer: ON Semiconductor; Prometheus_ManPartNo: NCP3337MN180R2G; Prometheus_Comment: NCP3337MN180R2G; Prometheus_CurrentFootprint: SON50P300X100_HS-11N
IC207 = IC_TLP291(BLL-TP,SE: Opto-Isolator / min. VCE = 80 V / min. Current Transfer Ratio = 200 % @ 5 mA; Prometheus_Manufacturer: Toshiba; Prometheus_ManPartNo: TLP291(BLL-TP,SE; Prometheus_Comment: TLP291(BLL-TP,SE; Prometheus_CurrentFootprint: SOP127P700X220-4N
L200 L203 = L_COMMONMODE_CHOKE_744282010_1: Prometheus_Manufacturer: TDK Corporation; Prometheus_ID: *; Prometheus_ManPartNo: ACP3225-102-2P-T000; Prometheus_Comment: ACP3225-102-2P-T000; Prometheus_CurrentFootprint: L_ACP3225-102-2P-T000
L201 L202 L204 L205 = L_COMMONMODE_CHOKE_DLW5BTM251SQ2L: 250 OHM @ 100 MHz / I max. 5A / DCR max. 20 mOHM / VDC max. 50 V; Prometheus_Manufacturer: Murata Electronics; Prometheus_ID: *; Prometheus_ManPartNo: DLW5BTM251SQ2L; Prometheus_Comment: DLW5BTM251SQ2L; Prometheus_CurrentFootprint: L_COMMON_DLW5BTM251SQ2L Prometheus
R200-R218 = R_GENERIC_DIN: Prometheus_ID: *; Prometheus_Manufacturer: *; Prometheus_CurrentFootprint: R_0603_N [RESC1608N IPC]
  R200 R202 R209: Prometheus_ManPartNo: 523k; Prometheus_Comment: 523k
  R201 R203-R205 R210 R211 R213 R217: Prometheus_ManPartNo: 100k; Prometheus_Comment: 100k
  R206 R208 R212: Prometheus_ManPartNo: 150R; Prometheus_Comment: 150R
  R207: Prometheus_ManPartNo: 560R; Prometheus_Comment: 560R
  R214: Prometheus_ManPartNo: 309k; Prometheus_Comment: 309k
  R215: Prometheus_ManPartNo: 1K5; Prometheus_Comment: 1K5
  R216: Prometheus_ManPartNo: 22K; Prometheus_Comment: 22K
  R218: Prometheus_ManPartNo: 68R; Prometheus_Comment: 68R
TP200-TP213 = TP_GENERIC: Needle Test Point; Prometheus_ID: *; Prometheus_ManPartNo: TP_GENERIC; Prometheus_Manufacturer: *; Prometheus_Comment: TP_GENERIC; Prometheus_CurrentFootprint: TP_0.8_P100T